# EAGLE design harp audio switch v1.0 (EAGLE 6.5.0)

## Sheet 1 of 3
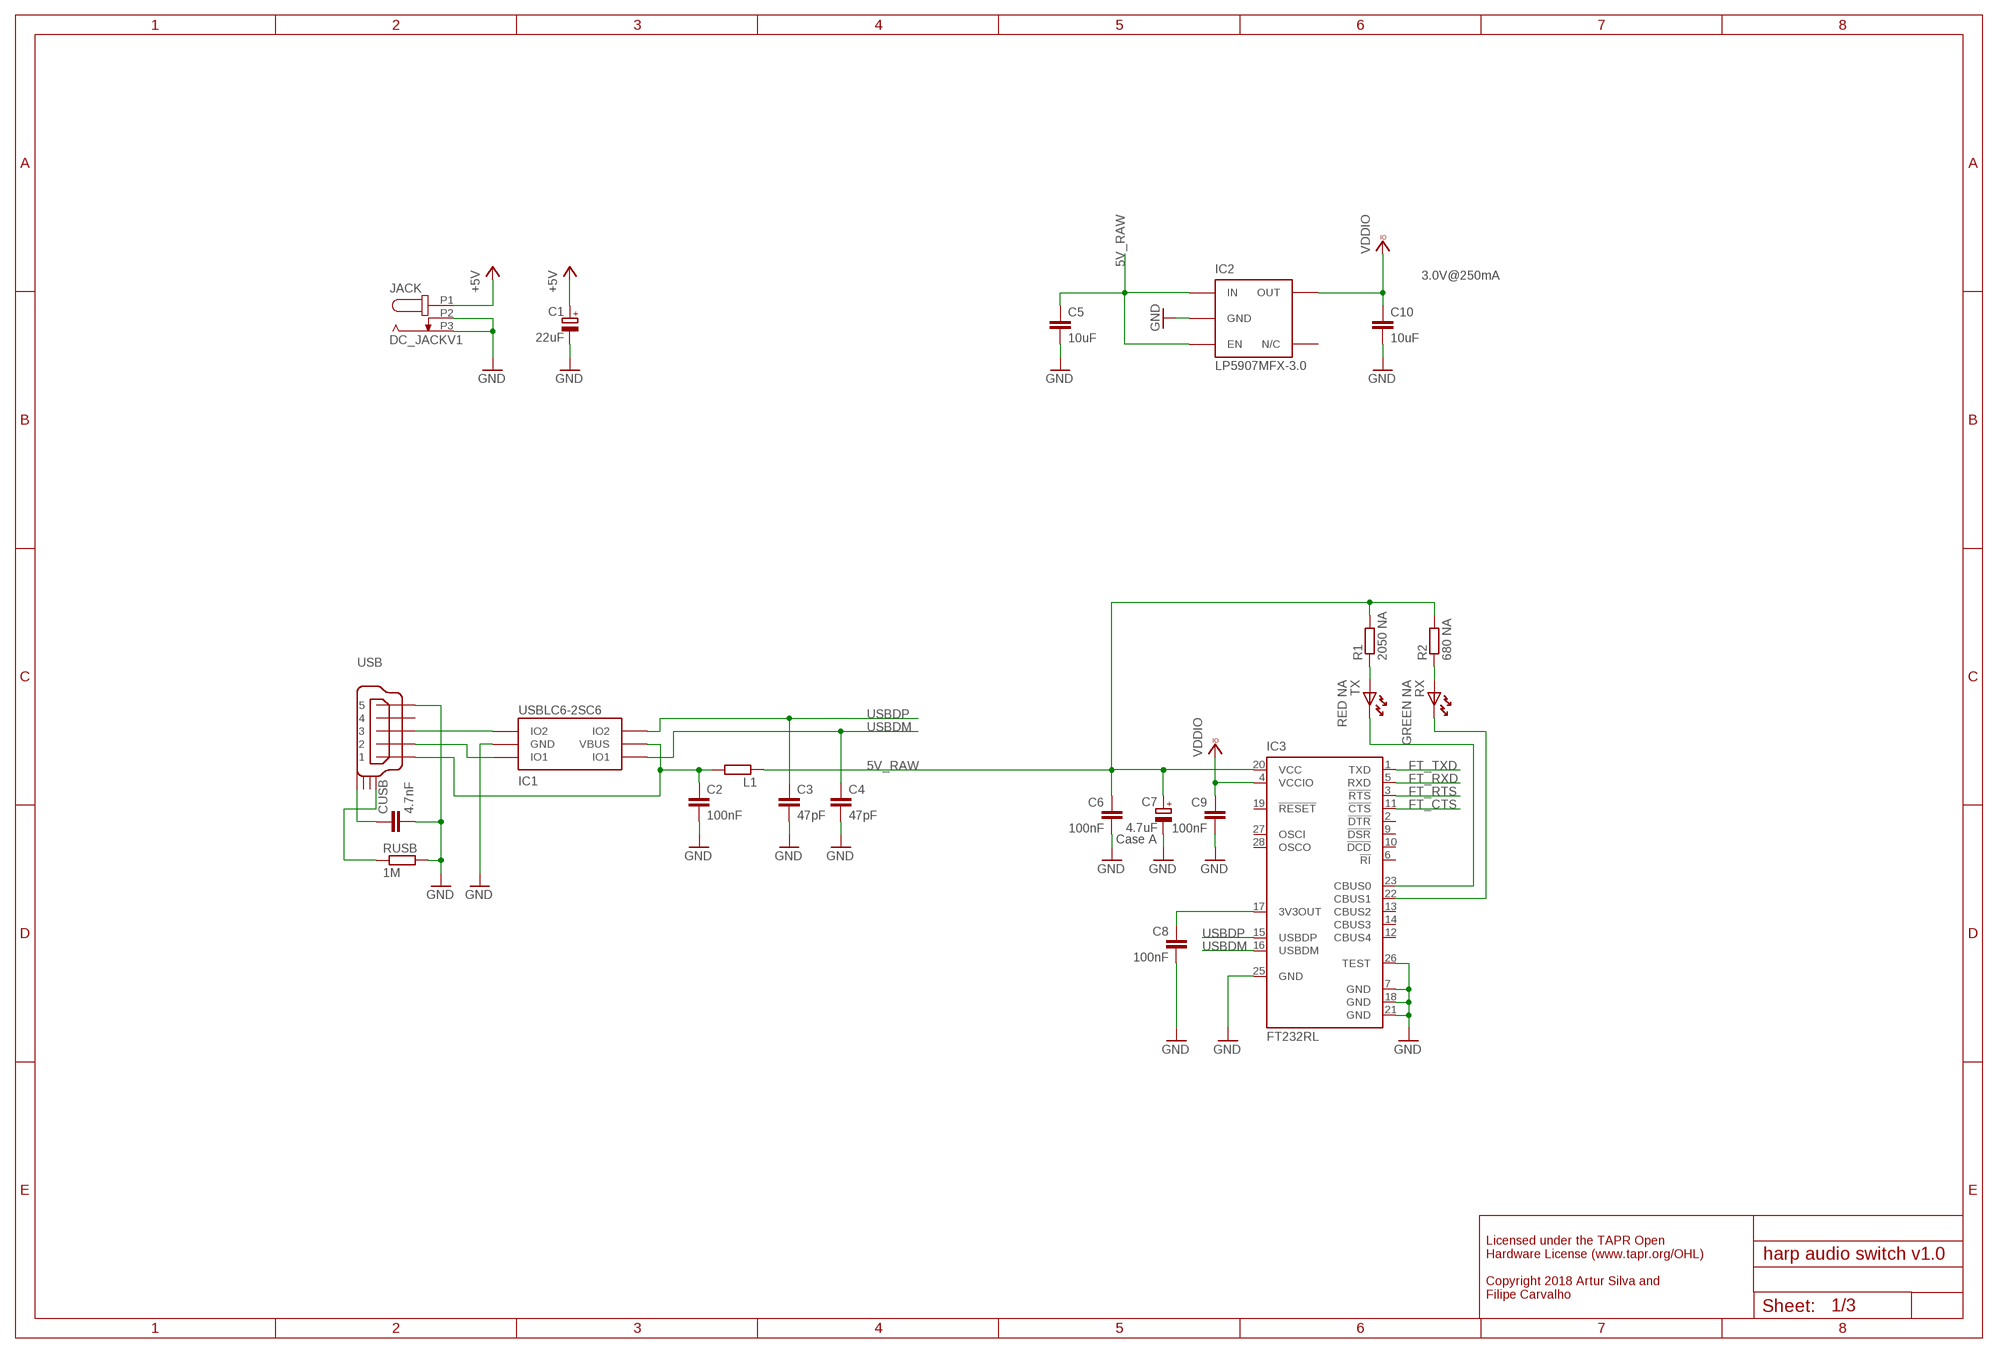
[diagram p0: schematic, sheet 1]

### Parts
C1  22uF  CAP_100UFHAND  [CAP_100UF_HAND]
C2  100nF  C-EUC0402  [C0402]
C3  47pF  C-EUC0402  [C0402]
C4  47pF  C-EUC0402  [C0402]
C5  10uF  C-EUC0603  [C0603]
C6  100nF  C-EUC0402  [C0402]
C7  4.7uF  CPOL-EUA/3216-18W  [A/3216-18W]
C8  100nF  C-EUC0402  [C0402]
C9  100nF  C-EUC0402  [C0402]
C10  10uF  C-EUC0603  [C0603]
CUSB  4.7nF  C-EUC0402  [C0402]
IC1  USBLC6-2SC6  USBLC6-2  [SOT23-6L]
IC2  LP5907MFX-3.0  TLV700XX  [TSOT23-5]
IC3  FT232RL  [SSOP28]
JACK  DC_JACKV1  [DC_POWER_INPUT]
L1  ???  R-EU_R0805  [R0805]
R1  2050 NA  R-EU_R0402  [R0402]
R2  680 NA  R-EU_R0402  [R0402]
RUSB  1M  R-EU_R0402  [R0402]
RX  GREEN NA  LEDHAND  [LED_HAND]
TX  RED NA  LEDHAND  [LED_HAND]
USB  USB_MINI_B  [240-0002-1]

### Nets
5V_RAW: C5.1 C6.1 C7.+ IC2.1(IN) IC2.3(EN) IC3.20(VCC) L1.1 R1.2 R2.2
+5V: C1.+ JACK.P1 ; also sheet 2,3
FT_CTS: IC3.11(!CTS) ; also sheet 2
FT_RTS: IC3.3(!RTS) ; also sheet 2
FT_RXD: IC3.5(RXD) ; also sheet 2
FT_TXD: IC3.1(TXD) ; also sheet 2
GND: C1.- C2.2 C3.2 C4.2 C5.2 C6.2 C7.- C8.2 C9.2 C10.2 CUSB.2 IC1.P$2(GND) IC2.2(GND) IC3.7(GND) IC3.18(GND) IC3.21(GND) IC3.25(GND) IC3.26(TEST) JACK.P2 JACK.P3 RUSB.2 USB.P$5 ; also sheet 2,3
N$38: C8.1 IC3.17(3V3OUT)
N$39: C2.1 IC1.P$5(VBUS) L1.2 USB.P$1
N$40: IC1.P$1(IO1) USB.P$2
N$47: R2.1 RX.A
N$48: IC3.23(CBUS0) TX.K
N$49: IC3.22(CBUS1) RX.K
N$50: IC1.P$3(IO2) USB.P$3
N$59: CUSB.1 USB.SHIELD_4
N$61: RUSB.1 USB.SHIELD_1
N$62: R1.1 TX.A
USBDM: C4.1 IC1.P$6(IO1) IC3.16(USBDM)
USBDP: C3.1 IC1.P$4(IO2) IC3.15(USBDP)
VCCIO: C9.1 C10.1 IC2.5(OUT) IC3.4(VCCIO) ; supply symbol labelled VDDIO ; also sheet 2,3
Unconnected: IC2.4(N/C) IC3.2(!DTR) IC3.6(!RI) IC3.9(!DSR) IC3.10(!DCD) IC3.12(CBUS4) IC3.13(CBUS2) IC3.14(CBUS3) IC3.19(!RESET) IC3.27(OSCI) IC3.28(OSCO) USB.P$4 USB.SHIELD_2 USB.SHIELD_3

### Notes on the sheet
- 3.0V@250mA
- Case A
- Licensed under the TAPR Open
  Hardware License (www.tapr.org/OHL)
  
  Copyright 2018 Artur Silva and 
  Filipe Carvalho

## Sheet 2 of 3
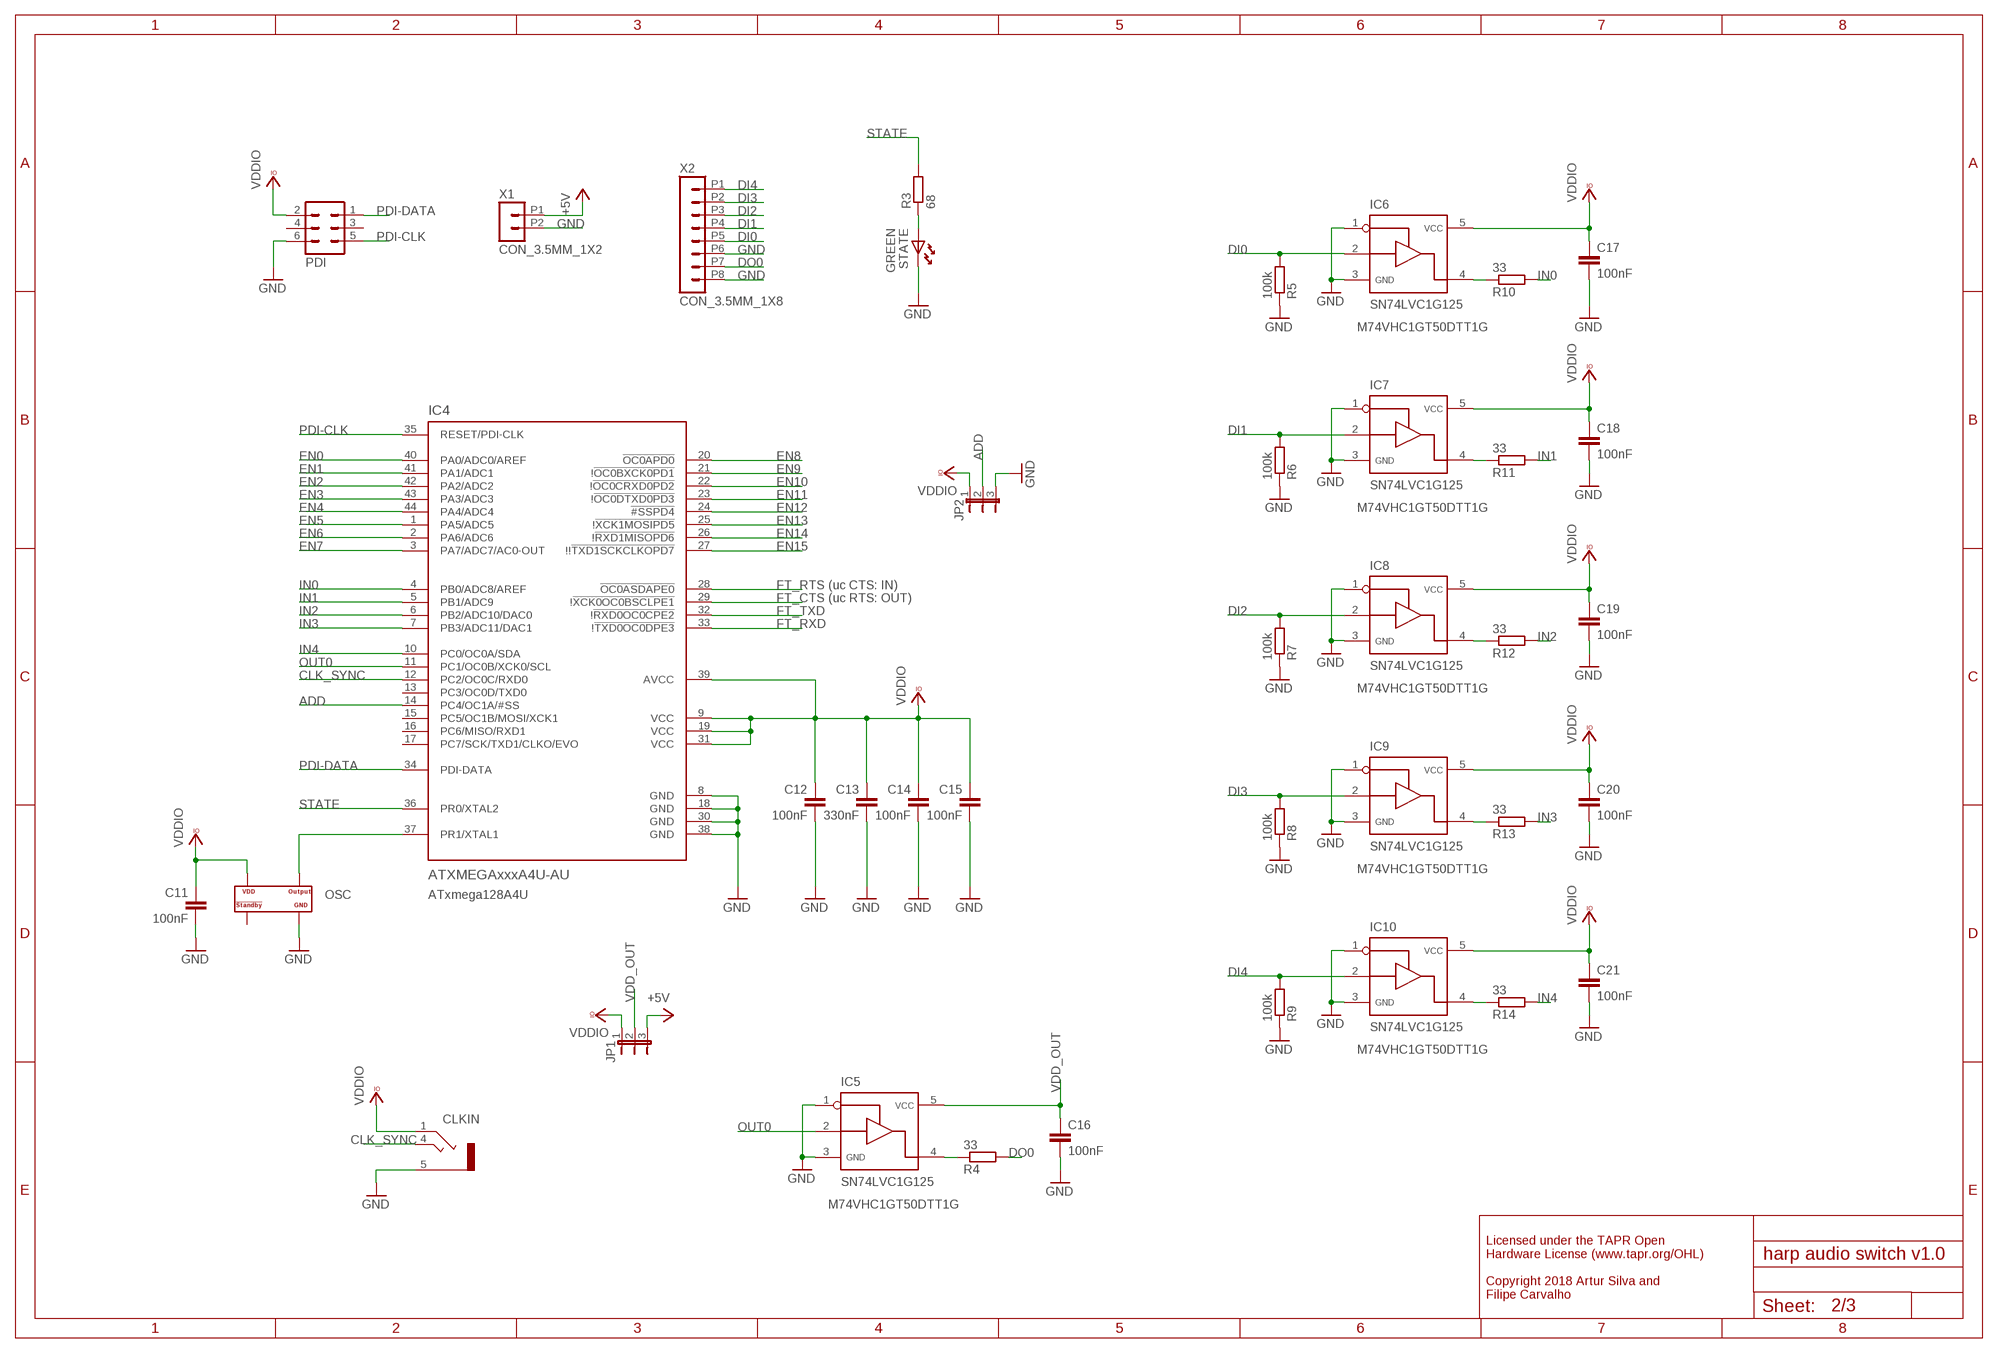
[diagram p1: schematic, sheet 2]

### Parts
C11  100nF  C-EUC0402  [C0402]
C12  100nF  C-EUC0402  [C0402]
C13  330nF  C-EUC0402  [C0402]
C14  100nF  C-EUC0402  [C0402]
C15  100nF  C-EUC0402  [C0402]
C16  100nF  C-EUC0402  [C0402]
C17  100nF  C-EUC0402  [C0402]
C18  100nF  C-EUC0402  [C0402]
C19  100nF  C-EUC0402  [C0402]
C20  100nF  C-EUC0402  [C0402]
C21  100nF  C-EUC0402  [C0402]
CLKIN  STEREO_JACK  [35RASMT2BHNTRX]
IC4  ATXMEGAxxxA4U-AU  AT-XMEGA-XXA4-AU  [QFP80P1200X1200X120-44N]
IC5  SN74LVC1G125  [SOT23-5]
IC6  SN74LVC1G125  [SOT23-5]
IC7  SN74LVC1G125  [SOT23-5]
IC8  SN74LVC1G125  [SOT23-5]
IC9  SN74LVC1G125  [SOT23-5]
IC10  SN74LVC1G125  [SOT23-5]
JP1  JP2E  [JP2]
JP2  JP2E  [JP2]
OSC  OSCILLATOR  [OSCILLATOR_3.2X2.5]
PDI  MA03-2  [MA03-2]
R3  68  R-EU_R0402  [R0402]
R4  33  R-EU_R0402  [R0402]
R5  100k  R-EU_R0402  [R0402]
R6  100k  R-EU_R0402  [R0402]
R7  100k  R-EU_R0402  [R0402]
R8  100k  R-EU_R0402  [R0402]
R9  100k  R-EU_R0402  [R0402]
R10  33  R-EU_R0402  [R0402]
R11  33  R-EU_R0402  [R0402]
R12  33  R-EU_R0402  [R0402]
R13  33  R-EU_R0402  [R0402]
R14  33  R-EU_R0402  [R0402]
STATE  GREEN  LEDHAND  [LED_HAND]
X1  CON_3.5MM_1X2  [CON_3.5MM_1X2]
X2  CON_3.5MM_1X8  [CON_3.5MM_1X8]

### Nets
+5V: JP1.3 X1.P1 ; also sheet 1,3
ADD: IC4.14(PC4/OC1A/#SS) JP2.2
CLK_SYNC: CLKIN.4 IC4.12(PC2/OC0C/RXD0)
DI0: IC6.2 R5.2 X2.P5
DI1: IC7.2 R6.2 X2.P4
DI2: IC8.2 R7.2 X2.P3
DI3: IC9.2 R8.2 X2.P2
DI4: IC10.2 R9.2 X2.P1
DO0: R4.2 X2.P7
EN0: IC4.40(PA0/ADC0/AREF) ; also sheet 3
EN1: IC4.41(PA1/ADC1) ; also sheet 3
EN2: IC4.42(PA2/ADC2) ; also sheet 3
EN3: IC4.43(PA3/ADC3) ; also sheet 3
EN4: IC4.44(PA4/ADC4) ; also sheet 3
EN5: IC4.1(PA5/ADC5) ; also sheet 3
EN6: IC4.2(PA6/ADC6) ; also sheet 3
EN7: IC4.3(PA7/ADC7/AC0-OUT) ; also sheet 3
EN8: IC4.20(!OC0APD0) ; also sheet 3
EN9: IC4.21(!!OC0BXCK0PD1) ; also sheet 3
EN10: IC4.22(!!OC0CRXD0PD2) ; also sheet 3
EN11: IC4.23(!!OC0DTXD0PD3) ; also sheet 3
EN12: IC4.24(!#SSPD4) ; also sheet 3
EN13: IC4.25(!!XCK1MOSIPD5) ; also sheet 3
EN14: IC4.26(!!RXD1MISOPD6) ; also sheet 3
EN15: IC4.27(!!!TXD1SCKCLKOPD7) ; also sheet 3
FT_CTS: IC4.29(!!XCK0OC0BSCLPE1) ; also sheet 1
FT_RTS: IC4.28(!OC0ASDAPE0) ; also sheet 1
FT_RXD: IC4.33(!!TXD0OC0DPE3) ; also sheet 1
FT_TXD: IC4.32(!!RXD0OC0CPE2) ; also sheet 1
GND: C11.2 C12.2 C13.2 C14.2 C15.2 C16.2 C17.2 C18.2 C19.2 C20.2 C21.2 CLKIN.5 IC4.8(GND) IC4.18(GND) IC4.30(GND) IC4.38(GND) IC5.1 IC5.3 IC6.1 IC6.3 IC7.1 IC7.3 IC8.1 IC8.3 IC9.1 IC9.3 IC10.1 IC10.3 JP2.3 OSC.P$2(GND) PDI.6 R5.1 R6.1 R7.1 R8.1 R9.1 STATE.K X1.P2 X2.P6 X2.P8 ; also sheet 1,3
IN0: IC4.4(PB0/ADC8/AREF) R10.2
IN1: IC4.5(PB1/ADC9) R11.2
IN2: IC4.6(PB2/ADC10/DAC0) R12.2
IN3: IC4.7(PB3/ADC11/DAC1) R13.2
IN4: IC4.10(PC0/OC0A/SDA) R14.2
N$2: IC5.4 R4.1
N$3: IC7.4 R11.1
N$4: IC6.4 R10.1
N$5: IC8.4 R12.1
N$6: IC9.4 R13.1
N$7: IC10.4 R14.1
N$23: R3.1 STATE.A
OSC2: IC4.37(PR1/XTAL1) OSC.P$3(OUTPUT)
OUT0: IC4.11(PC1/OC0B/XCK0/SCL) IC5.2
PDI-CLK: IC4.35(RESET/PDI-CLK) PDI.5
PDI-DATA: IC4.34(PDI-DATA) PDI.1
STATE: IC4.36(PR0/XTAL2) R3.2
VCCIO: C11.1 C12.1 C13.1 C14.1 C15.1 C17.1 C18.1 C19.1 C20.1 C21.1 CLKIN.1 IC4.9(VCC) IC4.19(VCC) IC4.31(VCC) IC4.39(AVCC) IC6.5 IC7.5 IC8.5 IC9.5 IC10.5 JP1.1 JP2.1 OSC.P$4(VDD) PDI.2 ; supply symbol labelled VDDIO ; also sheet 1,3
VDD_OUT: C16.1 IC5.5 JP1.2
Unconnected: IC4.13(PC3/OC0D/TXD0) IC4.15(PC5/OC1B/MOSI/XCK1) IC4.16(PC6/MISO/RXD1) IC4.17(PC7/SCK/TXD1/CLKO/EVO) OSC.P$1(STANDBY#) PDI.3 PDI.4

### Notes on the sheet
- M74VHC1GT50DTT1G
- M74VHC1GT50DTT1G
- (uc CTS: IN)
- (uc RTS: OUT)
- M74VHC1GT50DTT1G
- M74VHC1GT50DTT1G
- ATxmega128A4U
- M74VHC1GT50DTT1G
- M74VHC1GT50DTT1G
- Licensed under the TAPR Open
  Hardware License (www.tapr.org/OHL)
  
  Copyright 2018 Artur Silva and 
  Filipe Carvalho

## Sheet 3 of 3
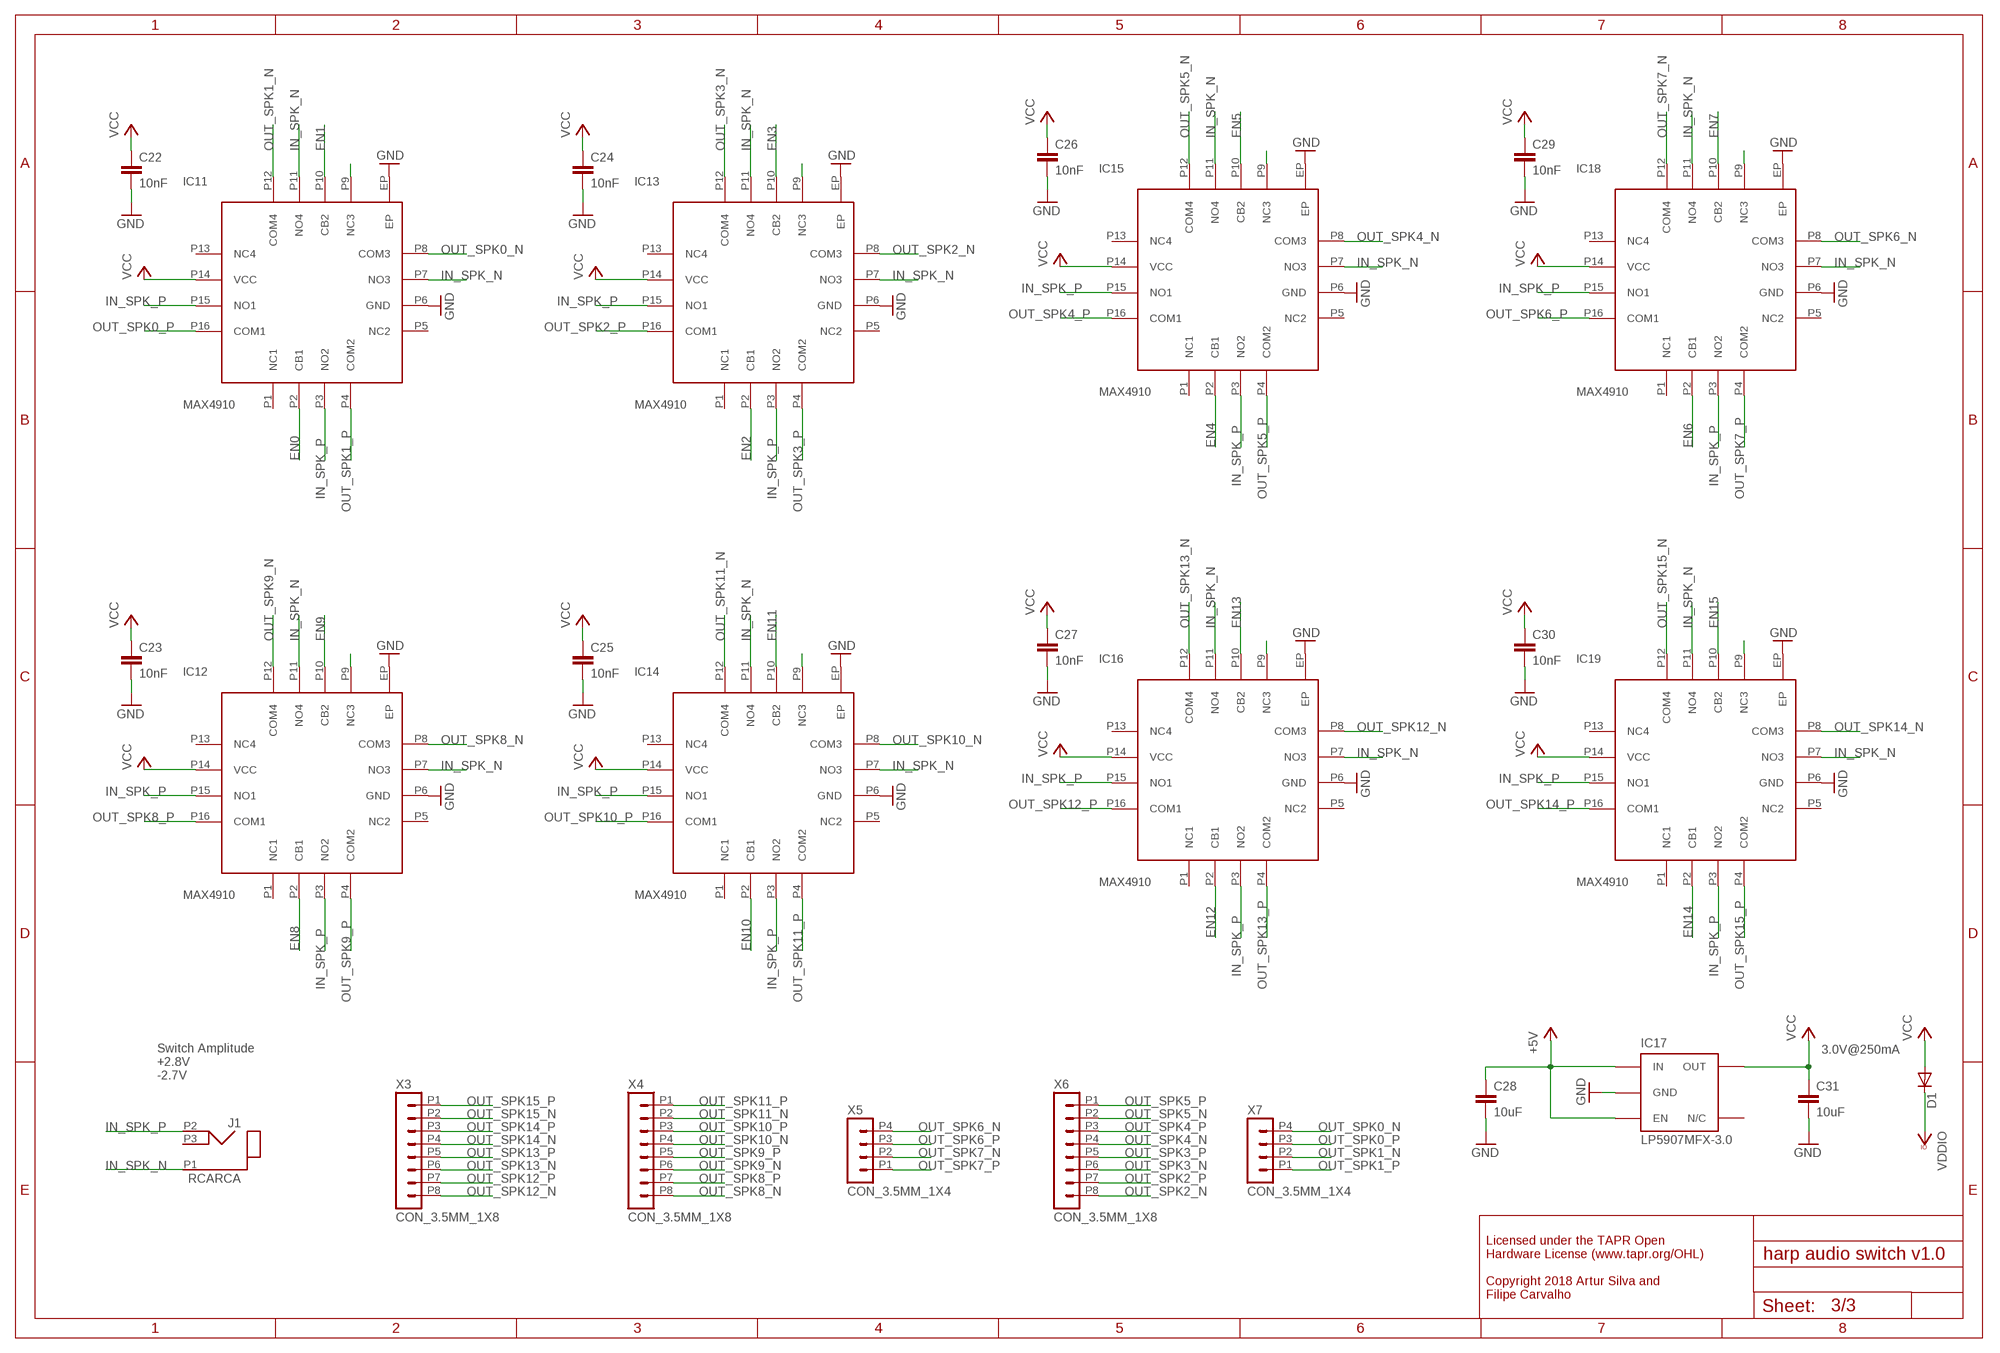
[diagram p2: schematic, sheet 3]

### Parts
C22  10nF  C-EUC0402  [C0402]
C23  10nF  C-EUC0402  [C0402]
C24  10nF  C-EUC0402  [C0402]
C25  10nF  C-EUC0402  [C0402]
C26  10nF  C-EUC0402  [C0402]
C27  10nF  C-EUC0402  [C0402]
C28  10uF  C-EUC0603  [C0603]
C29  10nF  C-EUC0402  [C0402]
C30  10nF  C-EUC0402  [C0402]
C31  10uF  C-EUC0603  [C0603]
D1  DIODE-SOD323-R  [SOD323-R]
IC11  MAX4910  [QFN16]
IC12  MAX4910  [QFN16]
IC13  MAX4910  [QFN16]
IC14  MAX4910  [QFN16]
IC15  MAX4910  [QFN16]
IC16  MAX4910  [QFN16]
IC17  LP5907MFX-3.0  TLV700XX  [TSOT23-5]
IC18  MAX4910  [QFN16]
IC19  MAX4910  [QFN16]
J1  RCARCA  [RCA]
X3  CON_3.5MM_1X8  [CON_3.5MM_1X8]
X4  CON_3.5MM_1X8  [CON_3.5MM_1X8]
X5  CON_3.5MM_1X4  [CON_3.5MM_1X4]
X6  CON_3.5MM_1X8  [CON_3.5MM_1X8]
X7  CON_3.5MM_1X4  [CON_3.5MM_1X4]

### Nets
+5V: C28.1 IC17.1(IN) IC17.3(EN) ; also sheet 1,2
EN0: IC11.P2(CB1) ; also sheet 2
EN1: IC11.P10(CB2) ; also sheet 2
EN2: IC13.P2(CB1) ; also sheet 2
EN3: IC13.P10(CB2) ; also sheet 2
EN4: IC15.P2(CB1) ; also sheet 2
EN5: IC15.P10(CB2) ; also sheet 2
EN6: IC18.P2(CB1) ; also sheet 2
EN7: IC18.P10(CB2) ; also sheet 2
EN8: IC12.P2(CB1) ; also sheet 2
EN9: IC12.P10(CB2) ; also sheet 2
EN10: IC14.P2(CB1) ; also sheet 2
EN11: IC14.P10(CB2) ; also sheet 2
EN12: IC16.P2(CB1) ; also sheet 2
EN13: IC16.P10(CB2) ; also sheet 2
EN14: IC19.P2(CB1) ; also sheet 2
EN15: IC19.P10(CB2) ; also sheet 2
GND: C22.2 C23.2 C24.2 C25.2 C26.2 C27.2 C28.2 C29.2 C30.2 C31.2 IC11.EP IC11.P6(GND) IC12.EP IC12.P6(GND) IC13.EP IC13.P6(GND) IC14.EP IC14.P6(GND) IC15.EP IC15.P6(GND) IC16.EP IC16.P6(GND) IC17.2(GND) IC18.EP IC18.P6(GND) IC19.EP IC19.P6(GND) ; also sheet 1,2
IN_SPK_N: IC11.P7(NO3) IC11.P11(NO4) IC12.P7(NO3) IC12.P11(NO4) IC13.P7(NO3) IC13.P11(NO4) IC14.P7(NO3) IC14.P11(NO4) IC15.P7(NO3) IC15.P11(NO4) IC16.P7(NO3) IC16.P11(NO4) IC18.P7(NO3) IC18.P11(NO4) IC19.P7(NO3) IC19.P11(NO4) J1.P1
IN_SPK_P: IC11.P3(NO2) IC11.P15(NO1) IC12.P3(NO2) IC12.P15(NO1) IC13.P3(NO2) IC13.P15(NO1) IC14.P3(NO2) IC14.P15(NO1) IC15.P3(NO2) IC15.P15(NO1) IC16.P3(NO2) IC16.P15(NO1) IC18.P3(NO2) IC18.P15(NO1) IC19.P3(NO2) IC19.P15(NO1) J1.P2
N$11: IC19.P9(NC3)
N$12: IC13.P9(NC3)
N$13: IC16.P9(NC3)
N$14: IC12.P9(NC3)
N$15: IC14.P9(NC3)
N$16: IC11.P9(NC3)
N$18: IC15.P9(NC3)
N$19: IC18.P9(NC3)
OUT_SPK0_N: IC11.P8(COM3) X7.P4
OUT_SPK0_P: IC11.P16(COM1) X7.P3
OUT_SPK1_N: IC11.P12(COM4) X7.P2
OUT_SPK1_P: IC11.P4(COM2) X7.P1
OUT_SPK2_N: IC13.P8(COM3) X6.P8
OUT_SPK2_P: IC13.P16(COM1) X6.P7
OUT_SPK3_N: IC13.P12(COM4) X6.P6
OUT_SPK3_P: IC13.P4(COM2) X6.P5
OUT_SPK4_N: IC15.P8(COM3) X6.P4
OUT_SPK4_P: IC15.P16(COM1) X6.P3
OUT_SPK5_N: IC15.P12(COM4) X6.P2
OUT_SPK5_P: IC15.P4(COM2) X6.P1
OUT_SPK6_N: IC18.P8(COM3) X5.P4
OUT_SPK6_P: IC18.P16(COM1) X5.P3
OUT_SPK7_N: IC18.P12(COM4) X5.P2
OUT_SPK7_P: IC18.P4(COM2) X5.P1
OUT_SPK8_N: IC12.P8(COM3) X4.P8
OUT_SPK8_P: IC12.P16(COM1) X4.P7
OUT_SPK9_N: IC12.P12(COM4) X4.P6
OUT_SPK9_P: IC12.P4(COM2) X4.P5
OUT_SPK10_N: IC14.P8(COM3) X4.P4
OUT_SPK10_P: IC14.P16(COM1) X4.P3
OUT_SPK11_N: IC14.P12(COM4) X4.P2
OUT_SPK11_P: IC14.P4(COM2) X4.P1
OUT_SPK12_N: IC16.P8(COM3) X3.P8
OUT_SPK12_P: IC16.P16(COM1) X3.P7
OUT_SPK13_N: IC16.P12(COM4) X3.P6
OUT_SPK13_P: IC16.P4(COM2) X3.P5
OUT_SPK14_N: IC19.P8(COM3) X3.P4
OUT_SPK14_P: IC19.P16(COM1) X3.P3
OUT_SPK15_N: IC19.P12(COM4) X3.P2
OUT_SPK15_P: IC19.P4(COM2) X3.P1
VCC: C22.1 C23.1 C24.1 C25.1 C26.1 C27.1 C29.1 C30.1 C31.1 D1.A IC11.P14(VCC) IC12.P14(VCC) IC13.P14(VCC) IC14.P14(VCC) IC15.P14(VCC) IC16.P14(VCC) IC17.5(OUT) IC18.P14(VCC) IC19.P14(VCC)
VCCIO: D1.C ; supply symbol labelled VDDIO ; also sheet 1,2
Unconnected: IC11.P1(NC1) IC11.P5(NC2) IC11.P13(NC4) IC12.P1(NC1) IC12.P5(NC2) IC12.P13(NC4) IC13.P1(NC1) IC13.P5(NC2) IC13.P13(NC4) IC14.P1(NC1) IC14.P5(NC2) IC14.P13(NC4) IC15.P1(NC1) IC15.P5(NC2) IC15.P13(NC4) IC16.P1(NC1) IC16.P5(NC2) IC16.P13(NC4) IC17.4(N/C) IC18.P1(NC1) IC18.P5(NC2) IC18.P13(NC4) IC19.P1(NC1) IC19.P5(NC2) IC19.P13(NC4) J1.P3

### Notes on the sheet
- 3.0V@250mA
- Switch Amplitude
  +2.8V
  -2.7V
- Licensed under the TAPR Open
  Hardware License (www.tapr.org/OHL)
  
  Copyright 2018 Artur Silva and 
  Filipe Carvalho

## Library data of the parts
C1 = CNP-miscellaneous:CAP_100UF
C2-C6 C8-C31 CUSB = rcl:C-EU: CAPACITOR, European symbol
C7 = rcl:CPOL-EU: POLARIZED CAPACITOR, European symbol
CLKIN = CNP-connectors:STEREO_JACK
D1 = diode:DIODE-: DIODE
IC1 = CNP 2:USBLC6-2
IC2 IC17 = CNP:TLV700XX
IC3 = ftdichip:FT232R: Source: http://www.ftdichip.com/Documents/DataSheets/DS_FT232R_v104.pdf; MPN: FT232RL; OC_FARNELL: 1146032; OC_NEWARK: 91K9918
IC4 = xmega-a4:AT-XMEGA-XXA4-AU: ATxMega a4 Serie
IC5-IC10 = My_library 0v2:SN74LVC1G125
IC11-IC16 IC18 IC19 = CNP-ics 1:MAX4910
J1 = CNP-connectors:RCA
JACK = CNP-miscellaneous:DC_JACK
JP1 JP2 = jumper:JP2E: JUMPER
L1 R1-R14 RUSB = rcl:R-EU_: RESISTOR, European symbol
OSC = CNP-miscellaneous:OSCILLATOR
PDI = con-lstb:MA03-2: PIN HEADER; OC_FARNELL: unknown; OC_NEWARK: unknown
RX STATE TX = CNP-miscellaneous:LED
USB = CNP-connectors:USB_MINI_B
X1 = CNP-connectors:CON_3.5MM_1X2
X2-X4 X6 = CNP-connectors:CON_3.5MM_1X8
X5 X7 = CNP-connectors:CON_3.5MM_1X4

## Board
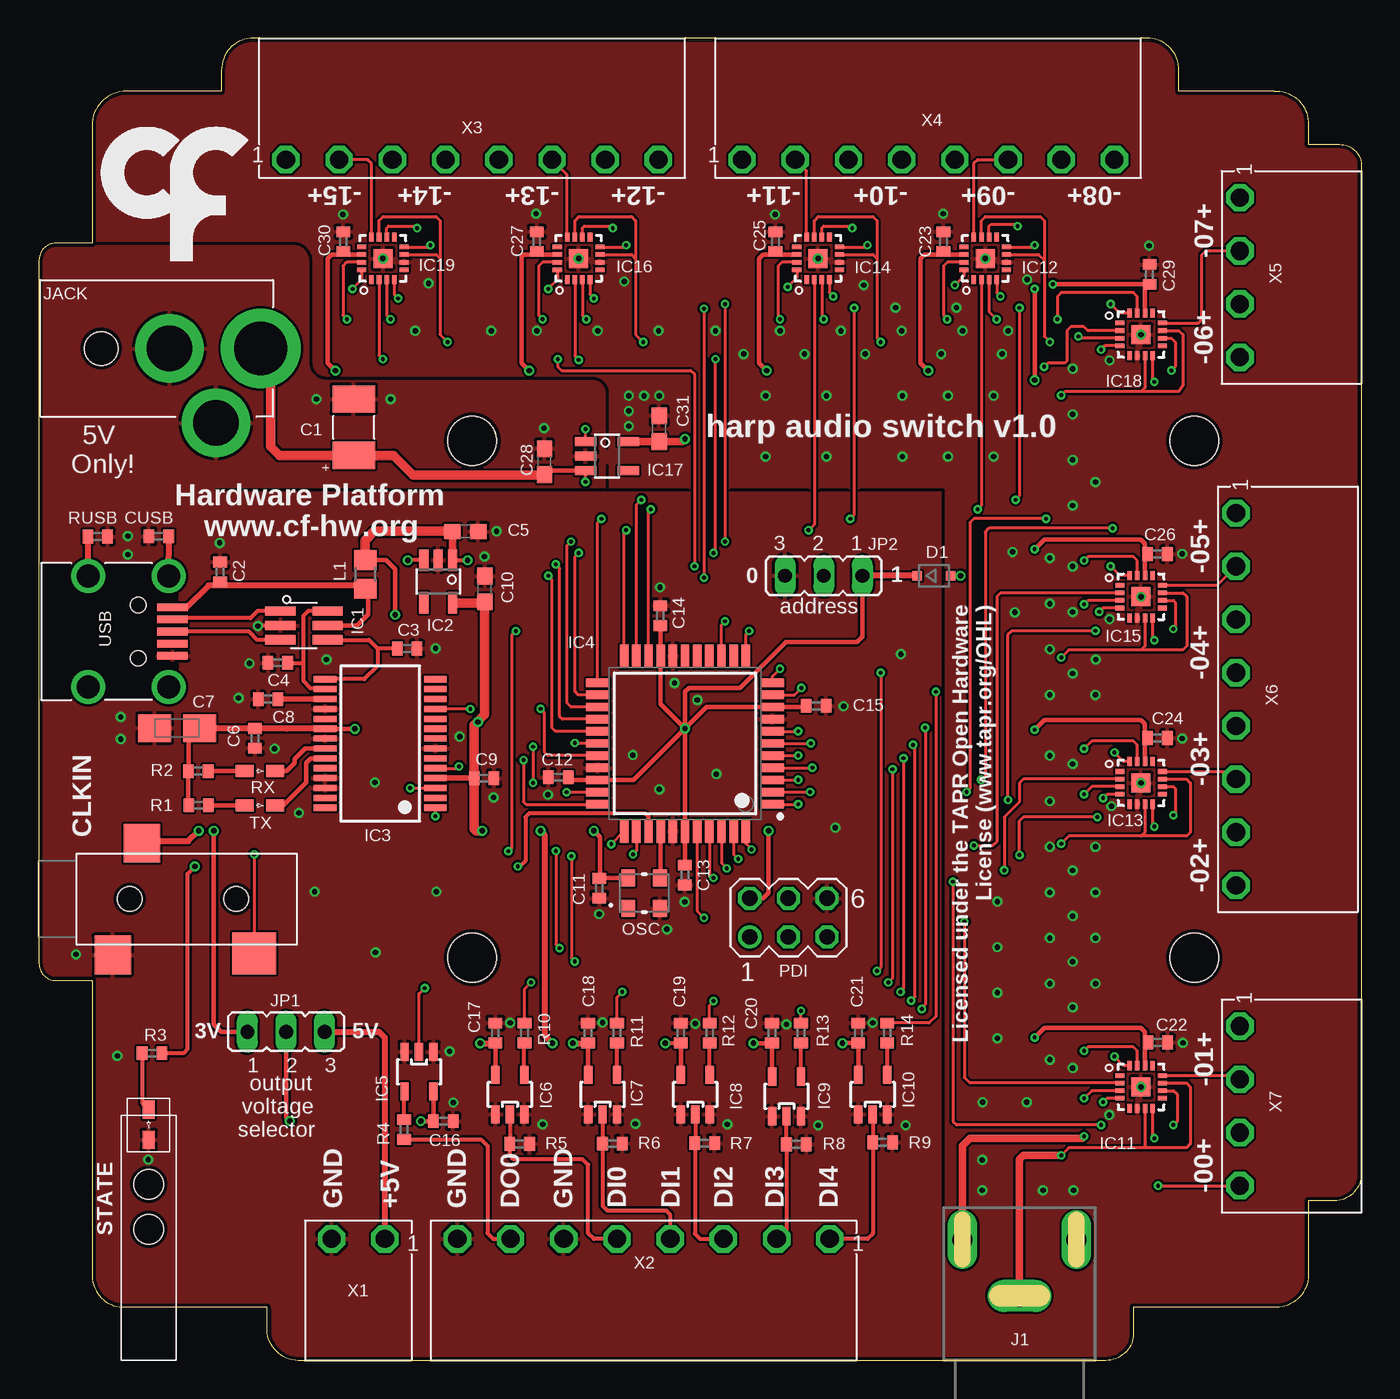
[diagram p3: board, top side]
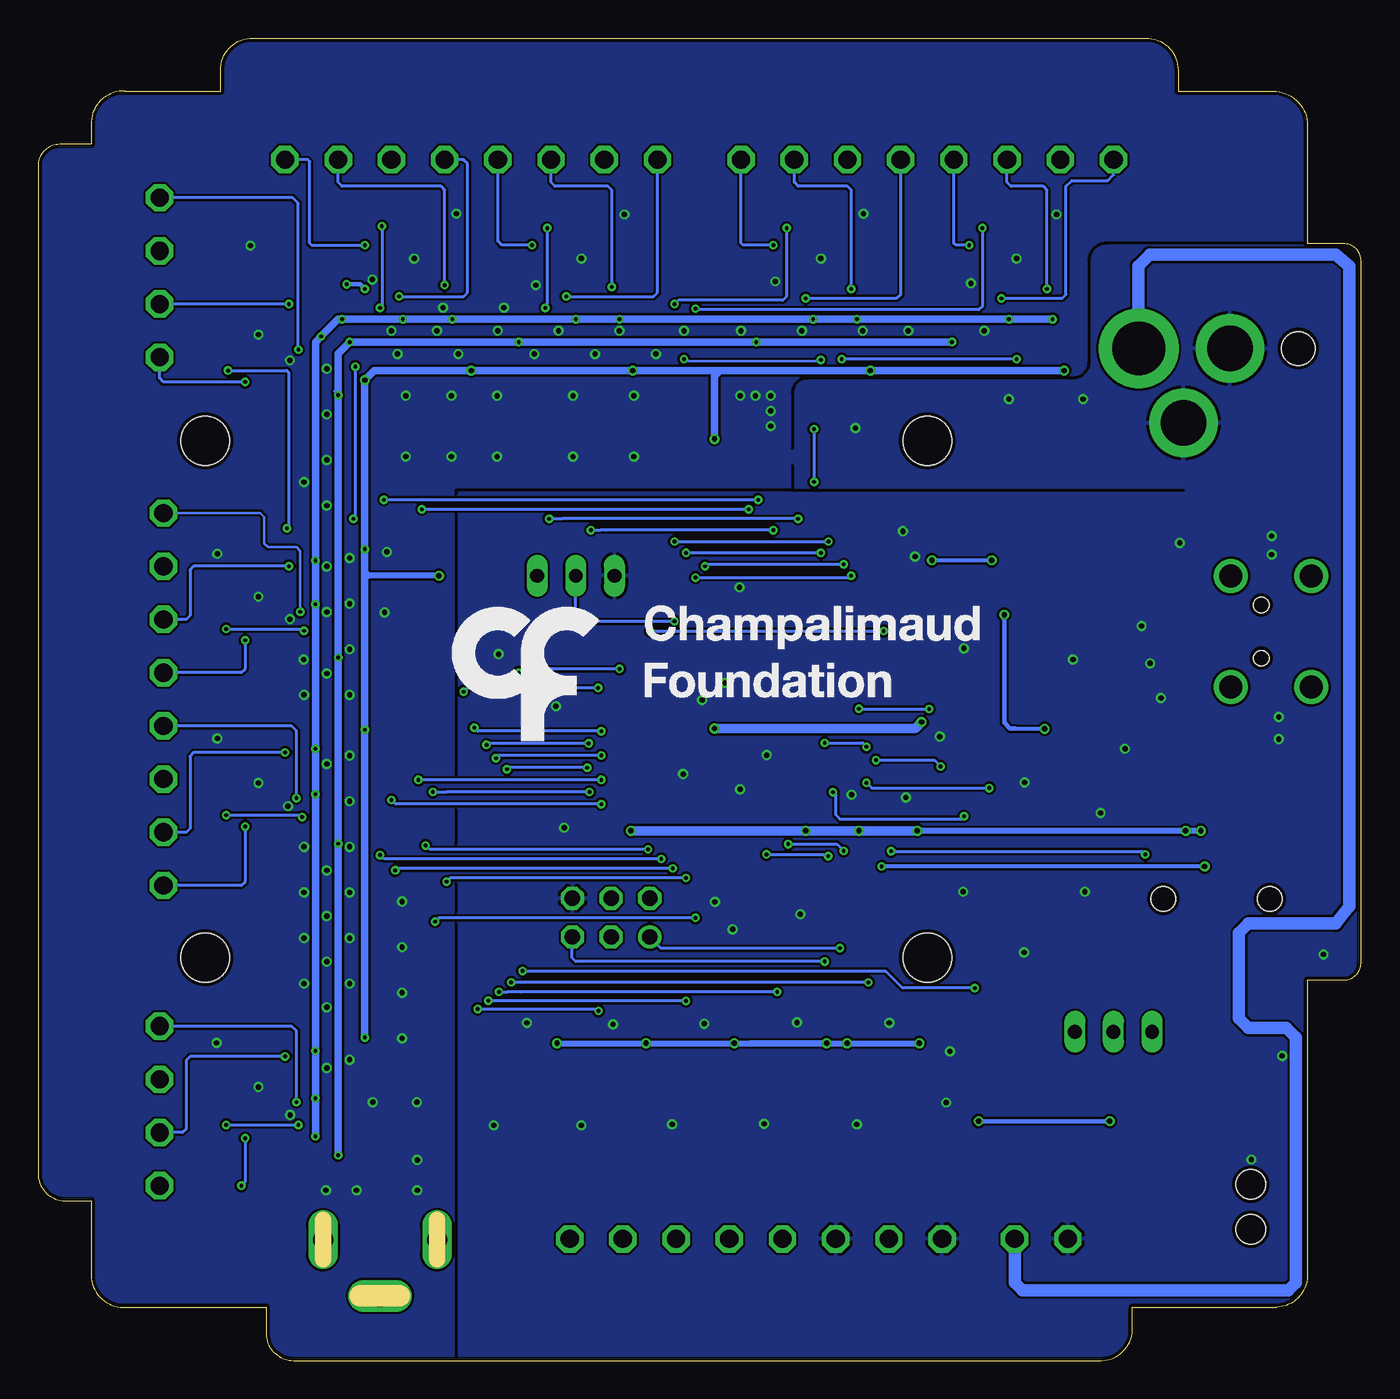
[diagram p4: board, bottom side, seen from below]

Size 87 x 87 mm. Coordinates in mm from the lower left corner, seen from the top.
Outline: 3.5,81.27 3.5,73.5 1.12,73.5 arc90 0,72.38 0,26.12 arc90 1.12,25 3.5,25 3.5,5.74 arc90 5.5,3.5 15,3.5 15,1.99 arc90 17.24,0 70.2,0 arc90 72,1.81 72,3.5 81.39,3.5 arc90 83.5,5.62 83.5,10.5 85.2,10.5 arc90 87,12.31 87,78.59 arc90 85.59,80 83.5,80 83.5,81.5 arc90 81.26,83.5 75,83.5 75,84.88 arc90 72.88,87 14.12,87 arc90 12,84.88 12,83.5 5.74,83.5 arc90 3.5,81.27
Copper layers (1*16): Top 0.018mm / dielectric 1.55mm / Bottom 0.018mm
Design rules "eC_2Layer_PClass6_BaseCopperO18_eCDefault *": minimum track width 0.15mm, minimum drill 0.25mm, track to track 0.15mm, track to pad 0.15mm, pad to pad 0.15mm, via to via 0.15mm, smd to smd 0mil, copper to edge 0.25mm, drill to drill 0.35mm, minimum pad ring 0.125mm, minimum via ring 0.125mm, stop-mask expansion 0mil, vias tented up to drill 0.45mm, thermal gap 0.2mm
Holes 3.2 mm at 28.5,60.5 28.5,26.5 76,60.5 76,26.5
tRestrict: 14 lines
bRestrict: 15 lines

### Footprints (pad centres in the part's own frame; a part is rotated, then mirrored left to right if it is on the bottom)
CAP_100UF_HAND = smd 1.8 x 2.8: + -1.85,0; - 1.85,0
C0402 = smd 0.7 x 0.9: 1 -0.65,0; 2 0.65,0
C0603 = smd 1.1 x 1: 1 -0.85,0; 2 0.85,0
A/3216-18W = smd 2.15 x 1.8: + 1.475,0; - -1.475,0
35RASMT2BHNTRX = smd 2.4 x 2.55: 1 0.8,3.675; 5 -1.1,-3.675 | smd 2.9 x 2.75: 4 8.2,-3.575 | hole 1.6: 0,0; 7,0
SOD323-R = smd 0.6 x 0.6: A 1.1,0; C -1.1,0
SOT23-6L = smd 0.6 x 2: P$1 -0.95,-1.55; P$2 0,-1.55; P$3 0.95,-1.55; P$4 0.95,1.55; P$5 0,1.55; P$6 -0.95,1.55
TSOT23-5 = smd 0.6 x 1.408: 1 -0.95,-1.404; 2 0,-1.404; 3 0.95,-1.404; 4 0.95,1.404; 5 -0.95,1.404
SSOP28 = smd 0.4 x 1.5: 1 -4.225,-3.625; 2 -3.575,-3.625; 3 -2.925,-3.625; 4 -2.275,-3.625; 5 -1.625,-3.625; 6 -0.975,-3.625; 7 -0.325,-3.625; 8 0.325,-3.625; 9 0.975,-3.625; 10 1.625,-3.625; 11 2.275,-3.625; 12 2.925,-3.625; 13 3.575,-3.625; 14 4.225,-3.625; 15 4.225,3.625; 16 3.575,3.625; 17 2.925,3.625; 18 2.275,3.625; 19 1.625,3.625; 20 0.975,3.625; 21 0.325,3.625; 22 -0.325,3.625; 23 -0.975,3.625; 24 -1.625,3.625; 25 -2.275,3.625; 26 -2.925,3.625; 27 -3.575,3.625; 28 -4.225,3.625
QFP80P1200X1200X120-44N = smd 1.55 x 0.55: 1 -5.75,4; 2 -5.75,3.2; 3 -5.75,2.4; 4 -5.75,1.6; 5 -5.75,0.8; 6 -5.75,0; 7 -5.75,-0.8; 8 -5.75,-1.6; 9 -5.75,-2.4; 10 -5.75,-3.2; 11 -5.75,-4; 23 5.75,-4; 24 5.75,-3.2; 25 5.75,-2.4; 26 5.75,-1.6; 27 5.75,-0.8; 28 5.75,0; 29 5.75,0.8; 30 5.75,1.6; 31 5.75,2.4; 32 5.75,3.2; 33 5.75,4 | smd 0.55 x 1.55: 12 -4,-5.75; 13 -3.2,-5.75; 14 -2.4,-5.75; 15 -1.6,-5.75; 16 -0.8,-5.75; 17 0,-5.75; 18 0.8,-5.75; 19 1.6,-5.75; 20 2.4,-5.75; 21 3.2,-5.75; 22 4,-5.75; 34 4,5.75; 35 3.2,5.75; 36 2.4,5.75; 37 1.6,5.75; 38 0.8,5.75; 39 0,5.75; 40 -0.8,5.75; 41 -1.6,5.75; 42 -2.4,5.75; 43 -3.2,5.75; 44 -4,5.75
SOT23-5 = smd 0.55 x 1.2: 1 -0.95,-1.3; 2 0,-1.3; 3 0.95,-1.3; 4 0.95,1.3; 5 -0.95,1.3
QFN16 = smd 1.25 x 1.25: EP 0,0 | smd 0.3 x 0.6: P1 -0.75,-1.4; P2 -0.25,-1.4; P3 0.25,-1.4; P4 0.75,-1.4; P9 0.75,1.4; P10 0.25,1.4; P11 -0.25,1.4; P12 -0.75,1.4 | smd 0.6 x 0.3: P5 1.4,-0.75; P6 1.4,-0.25; P7 1.4,0.25; P8 1.4,0.75; P13 -1.4,0.75; P14 -1.4,0.25; P15 -1.4,-0.25; P16 -1.4,-0.75
RCA = drill 1.4 long: P1 0,0 | drill 1.3 long: P2 3.7,3.75; P3 3.7,-3.75
DC_POWER_INPUT = drill 3.5: P1 8.5,0 | drill 3: P2 2.5,0; P3 5.55,-4.9 | hole 2.2: -2,0
JP2 = drill 0.914 long: 1 -2.54,0; 2 0,0; 3 2.54,0
R0805 = smd 1.3 x 1.5: 1 -0.95,0; 2 0.95,0
OSCILLATOR_3.2X2.5 = smd 0.9 x 1.1: P$1 -1.05,-1; P$2 1.05,-1; P$3 1.05,1; P$4 -1.05,1
MA03-2 = drill 1.016: 1 -2.54,-1.27 | drill 1.016 octagon: 2 -2.54,1.27; 3 0,-1.27; 4 0,1.27; 5 2.54,-1.27; 6 2.54,1.27
R0402 = smd 0.7 x 0.9: 1 -0.65,0; 2 0.65,0
LED_HAND = smd 1.2 x 0.8: A -1,0; K 1,0
LED_PIPE_7513D2-L = hole 1.93: -1.486,0; 1.486,0
240-0002-1 = smd 0.5 x 2: P$1 -1.6,8.65; P$2 -0.8,8.65; P$3 0,8.65; P$4 0.8,8.65; P$5 1.6,8.65 | drill 1.5: SHIELD_1 -3.65,3.1; SHIELD_2 3.65,3.1; SHIELD_3 3.65,8.4; SHIELD_4 -3.65,8.4 | hole 1: -1.75,6.4; 1.75,6.4
CON_3.5MM_1X2 = drill 1.2 octagon: P1 -1.75,0; P2 1.75,0
CON_3.5MM_1X8 = drill 1.2 octagon: P1 -12.25,0; P2 -8.75,0; P3 -5.25,0; P4 -1.75,0; P5 1.75,0; P6 5.25,0; P7 8.75,0; P8 12.25,0
CON_3.5MM_1X4 = drill 1.2 octagon: P1 -5.25,0; P2 -1.75,0; P3 1.75,0; P4 5.25,0

### Placement (x,y rotation side)
C1  20.7,61.4 90 top
C2  11.92,51.88 90 top
C3  24.22,46.84 0 top
C4  15.71,45.9 180 top
C5  28.05,54.54 0 top
C6  14.21,40.93 270 top
C7  9.09,41.61 0 top
C8  15.08,43.51 180 top
C9  29.28,38.31 0 top
C10  29.33,50.76 90 top
C11  36.86,31.07 270 top
C12  34.16,38.37 180 top
C13  42.49,31.94 270 top
C14  40.88,49 90 top
C15  51.13,43.07 0 top
C16  26.6,15.75 0 top
C17  30.02,21.55 90 top
C18  36.12,21.55 90 top
C19  42.23,21.55 90 top
C20  48.23,21.55 90 top
C21  53.9,21.55 90 top
C22  73.6,20.93 0 top
C23  59.5,73.6 90 top
C24  73.58,40.95 0 top
C25  48.45,73.6 90 top
C26  73.58,53.05 0 top
C27  32.75,73.6 90 top
C28  33.25,59.13 90 top
C29  73.05,71.45 90 top
C30  20.02,73.6 90 top
C31  40.8,61.3 90 top
CLKIN  5.96,30.36 0 top
CUSB  7.88,54.22 180 top
D1  58.88,51.63 0 top
IC1  17.44,48.36 270 top
IC2  26.27,51.25 180 top
IC3  22.45,40.59 90 top
IC4  42.5,40.59 180 top
IC5  25,19 180 top
IC6  30.98,17.5 0 top
IC7  37.08,17.5 0 top
IC8  43.17,17.5 0 top
IC9  49.17,17.38 0 top
IC10  54.85,17.5 0 top
IC11  72.5,18 270 top
IC12  62.25,72.5 0 top
IC13  72.5,38 270 top
IC14  51.25,72.5 0 top
IC15  72.5,50.25 270 top
IC16  35.5,72.5 0 top
IC17  37.38,59.5 270 top
IC18  72.5,67.5 270 top
IC19  22.62,72.5 0 top
J1  64.5,4.25 90 top
JACK  6.09,66.58 0 top
JP1  16.25,21.63 0 top
JP2  51.62,51.63 180 top
L1  21.48,51.72 270 top
OSC  39.81,30.75 0 top
PDI  49.3,29.14 0 top
R1  10.5,36.53 180 top
R2  10.48,38.78 180 top
R3  7.44,20.22 0 top
R4  24.02,15.2 270 top
R5  31.62,14.25 180 top
R6  37.73,14.28 180 top
R7  43.8,14.3 180 top
R8  49.83,14.23 180 top
R9  55.5,14.35 180 top
R10  31.95,21.55 90 top
R11  38.02,21.55 90 top
R12  44.12,21.55 90 top
R13  50.12,21.55 90 top
R14  55.8,21.55 90 top
RUSB  3.87,54.21 0 top
RX  14.53,38.78 0 top
STATE  7.21,15.52 270 top
TX  14.53,36.53 0 top
U$1  [LED_PIPE_7513D2-L]  7.21,10.11 90 top
U$3  [LOGO_5]  56.68,46.47 0 bottom
U$9  [LOGO_6]  7.25,78.08 0 top
USB  0.13,47.96 270 top
X1  21,8 180 top
X2  39.77,8 180 top
X3  28.5,79 0 top
X4  58.5,79 0 top
X5  79,71.25 270 top
X6  78.75,43.5 270 top
X7  79,16.75 270 top

### Tracks (layer width: path | path; a pad name or v marks a point on that pad's centre or on a via)
5V_RAW  (via drill 0.35 pad 0.65)
  Top 0.254: IC2.3 v24.27,52.65 v24.26,52.64 | v28.2,52.64 27.22,52.64 IC2.1
  Top 0.305: 16.31,41.57 C6.1 | v20.78,41.56 IC3.20 | R1.2 9.83,36.55 R2.2 9.84,38.79 9.84,41.46 9.7,41.6 10.56,41.6 C7.+ | v23.43,49.06 23.43,52.07 22.85,52.65 21.49,52.65 L1.1 | IC2.1
  Top 0.406: IC3.20 16.31,41.57 10.61,41.57 C7.+ | L1.1 21.54,52.73
  Top 0.508: IC2.1 C5.1 | 27.16,54.5 C5.1 | 27.25,54.59 C5.1
  Top 0.61: C5.1 22.05,54.55 21.45,53.95 21.45,52.7 L1.1
  Bottom 0.254: v24.26,52.64 v28.2,52.64
  Bottom 0.305: v23.43,49.06 23.43,41.96 23.06,41.57 22.7,41.57 v20.78,41.56
+5V  (via drill 0.25 pad 0.55)
  Top 0.203: IC17.1 35.97,61.38 v35.95,61.28 | v35.95,57.8 35.95,58.53 IC17.3
  Top 0.305: IC17.3 33.52,58.55 C28.1
  Top 0.406: JP1.3 22.38,21.63 22.75,21.25 X1.P1
  Top 0.61: C28.1 33.23,58.25 24.62,58.25 23.33,59.55 C1.+ 15.83,59.55 15.25,60.13 15.25,65.93 JACK.P1
  Bottom 0.203: v35.95,61.28 v35.95,57.8
  Bottom 0.813: JACK.P1 14.62,66.62 14.62,72 13.88,72.75 1.62,72.75 0.75,72 0.75,29.88 1.62,28.75 7.38,28.75 8,28.13 8,22.5 7.38,21.88 4.88,21.88 4.25,21.25 4.25,5.13 4.75,4.63 22.25,4.63 22.75,5.13 X1.P1
ADD  (via drill 0.25 pad 0.55)
  Top 0.203: IC4.14 44.9,48.4 v45.12,48.63
  Bottom 0.203: v45.12,48.63 51.5,48.63 51.62,48.75 JP2.2
CLK_SYNC  (via drill 0.25 pad 0.55)
  Top 0.203: v14.16,33.29 CLKIN.4 | v30.88,33.5 31.12,33.75 31.12,47.75 v31.36,47.99 | IC4.12 46.5,47.78 v46.72,47.99
  Top 0.254: CLKIN.4 | v30.88,33.5 30.75,33.5
  Bottom 0.203: v30.88,33.5 14.38,33.5 v14.16,33.29 | v46.72,47.99 31.99,47.99 v31.36,47.99
DI0
  Top 0.254: IC6.2 R5.2 30.98,13.48 31.2,13.25 35.75,13.25 36.12,12.88 36.12,8.38 36.5,8 X2.P5
DI1
  Top 0.254: IC7.2 R6.2 37.08,10.18 37.38,9.88 41.25,9.88 41.5,9.63 41.5,8.03 X2.P4
DI2
  Top 0.254: IC8.2 43.17,14.33 R7.2 43.15,8.35 43.5,8 X2.P3
DI3
  Top 0.254: IC9.2 R8.2 49.17,8.65 X2.P2
DI4
  Top 0.254: IC10.2 R9.2 54.85,8.35 54.5,8 X2.P1
DO0
  Top 0.254: R4.2 29.07,14.55 29.5,14.13 29.5,8.38 29.88,8 X2.P7
EN0  (via drill 0.25 pad 0.55)
  Top 0.203: IC4.40 43.3,29.58 v43.75,29.13 | v60.88,28.88 60.88,18.63 61.25,18.25 IC11.P2
  Bottom 0.203: v43.75,29.13 60.62,29.13 v60.88,28.88
EN1  (via drill 0.25 pad 0.55)
  Top 0.203: IC11.P10 74.62,17.75 74.88,17.5 74.88,15.75 v74.62,15.5 | IC4.41 44.1,32.03 v44.38,31.75 | v60.12,31.5 60.12,15.75 60.38,15.5 v69.88,15.5
  Bottom 0.203: v74.62,15.5 v69.88,15.5 | v44.38,31.75 59.88,31.75 v60.12,31.5
EN2  (via drill 0.25 pad 0.55)
  Top 0.203: IC13.P2 64.75,38.25 64.5,38 64.5,36.75 63.5,35.75 v63.5,32.25 | IC4.42 44.9,32.73 v45.25,32.38
  Bottom 0.203: v45.25,32.38 63.25,32.38 v63.5,32.25
EN3  (via drill 0.25 pad 0.55)
  Top 0.203: IC13.P10 74.62,37.75 74.75,37.63 74.75,36 v74.62,35.88 | v69.62,35.75 64.75,35.75 64.5,35.5 v64.5,33.25 | IC4.43 45.7,33.3 v46,33
  Bottom 0.203: v74.62,35.88 69.75,35.88 v69.62,35.75 | v46,33 64.25,33 v64.5,33.25
EN4  (via drill 0.25 pad 0.55)
  Top 0.203: IC15.P2 63.25,50.5 63,50.25 63,34.13 62.75,33.88 v61.5,33.88 | IC4.44 46.5,34 v46.88,33.63
  Bottom 0.203: v46.88,33.63 61.25,33.63 v61.5,33.88
EN5  (via drill 0.25 pad 0.55)
  Top 0.203: IC15.P10 74.62,50 74.75,49.88 74.75,48.25 v74.62,48.13 | v69.5,48 64,48 63.75,47.75 v63.75,36.88 | IC4.1 49.86,36.59 v49.95,36.6
  Bottom 0.203: v74.62,48.13 69.62,48.13 v69.5,48 | v49.95,36.6 63.48,36.6 v63.75,36.88
EN6  (via drill 0.25 pad 0.55)
  Top 0.203: IC18.P2 69,67.75 68.75,68 67.88,68 67.62,67.75 67.62,65.75 67.5,65.63 66.38,65.63 v66.12,65.38 | IC4.2 50.71,37.39 v50.73,37.4 | v66.25,55.38 61.5,55.38 61.25,55.13 61.25,37.63 v61.02,37.4
  Bottom 0.203: v50.73,37.4 60.12,37.4 v61.02,37.4 | v66.12,65.38 66.12,55.38 v66.25,55.38
EN7  (via drill 0.25 pad 0.55)
  Top 0.203: IC18.P10 74.5,67.25 74.75,67 74.75,65.38 v74.5,65.13 | IC4.3 v49.94,38.19 v49.95,38.2 | v70.62,54.75 62.5,54.75 62.25,54.5 62.25,38.48 v61.98,38.2
  Bottom 0.203: v74.5,65.13 70.62,65.13 70.5,65 70.5,54.88 v70.62,54.75 | v49.95,38.2 v61.98,38.2
EN8  (via drill 0.25 pad 0.55)
  Top 0.203: IC4.20 40.1,55.85 v40.25,56 | IC12.P2 62,56.25 v61.75,56
  Bottom 0.203: v61.75,56 v40.25,56
EN9  (via drill 0.25 pad 0.55)
  Top 0.203: IC12.P10 62.5,74.63 62.62,74.75 64.25,74.75 v64.38,74.63 | IC4.21 39.3,56.3 v39.62,56.63 | v64.5,69.25 64.5,56.88 v64.25,56.63
  Bottom 0.203: v64.38,74.63 64.38,69.38 v64.5,69.25 | v64.25,56.63 v39.62,56.63
EN10  (via drill 0.25 pad 0.55)
  Top 0.203: IC14.P2 51,55 v50.62,54.63 | IC4.22 38.5,54.5 v38.62,54.63
  Bottom 0.203: v38.62,54.63 49.62,54.63 50,54.63 v50.62,54.63
EN11  (via drill 0.25 pad 0.55)
  Top 0.203: IC14.P10 51.5,74.5 51.62,74.63 53.38,74.63 v53.5,74.5 | v53.62,69.25 53.62,55.63 v53.38,55.38 | IC4.23 36.75,55.13 v37,55.38
  Bottom 0.203: v53.5,74.5 53.5,69.38 v53.62,69.25 | v37,55.38 52.25,55.38 52.5,55.38 v53.38,55.38
EN12  (via drill 0.25 pad 0.55)
  Top 0.203: IC16.P2 35.25,66.08 v35.5,65.83 | IC4.24 35.46,43.79 35.25,44 35.25,52.88 v35.5,53.13 | v44.38,53.13 44.5,53.25 v44.5,65.88
  Bottom 0.203: v35.5,53.13 v44.38,53.13 | v35.5,65.83 35.62,65.73 44.38,65.75 v44.5,65.88
EN13  (via drill 0.25 pad 0.55)
  Top 0.203: IC16.P10 35.75,74.5 35.88,74.63 37.62,74.63 v37.75,74.5 | IC4.25 35.01,42.99 34.75,43.25 34.75,53.63 v35,53.88 | v45.12,69.5 v45.12,53.88
  Bottom 0.203: v37.75,74.5 37.75,70 38,69.75 44.88,69.75 v45.12,69.5 | v45.12,53.88 v35,53.88
EN14  (via drill 0.25 pad 0.55)
  Top 0.203: IC19.P2 22.38,66.13 v22.62,65.88 | IC4.26 34.44,42.19 34.25,42.38 34.25,52.13 v34,52.38 | v34.12,65.88 34.12,65.38 34.38,65.13 42.88,65.13 43.12,64.88 v43.12,52.25
  Bottom 0.203: v22.62,65.88 v34.12,65.88 | v34,52.38 43,52.38 v43.12,52.25
EN15  (via drill 0.25 pad 0.55)
  Top 0.203: IC19.P10 22.88,74.5 23,74.63 24.75,74.63 v24.88,74.5 | IC4.27 33.99,41.39 33.75,41.63 33.75,51.38 v33.5,51.63 | v43.75,69.2 v43.75,51.5
  Bottom 0.203: v24.88,74.5 24.88,69.38 25.12,69.13 43.62,69.13 v43.75,69.2 | v43.75,51.5 33.62,51.5 v33.5,51.63
FT_CTS  (via drill 0.25 pad 0.55)
  Top 0.203: v28.38,42.86 IC3.11 | IC4.29 33.46,39.79 33.25,40 33.25,42.63 v33,42.88
  Top 0.254: 26.09,42.88 IC3.11 | 28.51,42.86 v28.38,42.86
  Top 0.305: 26.09,42.88 IC3.11
  Bottom 0.203: v33,42.88 28.39,42.88 v28.38,42.86
FT_RTS  (via drill 0.25 pad 0.55)
  Top 0.203: v24.42,37.66 IC3.3 | IC4.28 35.29,40.59 v35.25,40.63 | v32.5,40.38 v32.5,38
  Top 0.305: IC3.3
  Bottom 0.203: v24.42,37.66 32.16,37.66 v32.5,38 | v35.25,40.63 32.75,40.63 v32.5,40.38
FT_RXD  (via drill 0.25 pad 0.55)
  Top 0.203: IC3.5 27.5,38.96 v27.63,39.09 | v31.88,39.5 31.88,36.76 32.05,36.59 IC4.33
  Top 0.305: 26.12,38.93 IC3.5
  Top 0.406: 26.09,38.97 IC3.5
  Bottom 0.203: v31.88,39.5 28.05,39.5 v27.63,39.09
FT_TXD  (via drill 0.25 pad 0.55)
  Top 0.203: 26.06,36.39 IC3.1 v26.08,35.81 | v34.71,37.39 IC4.32 | IC4.32
  Bottom 0.203: v26.08,35.81 26.26,35.63 34.25,35.63 34.5,35.88 34.5,37.19 v34.71,37.39
GND  (via drill 0.35 pad 0.65)
  Top 0.305: IC1.P$2 14.44,48.36 v14.4,48.33 | IC4.30
  other vias: 18.92,46.12 5.85,54.24 5.85,53.03 11.89,53.79 26.09,46.85 13.84,45.86 13.13,43.59 15.5,40.25 5.38,42.33 5.38,40.88 5.16,20.05 29.9,37.04 29.31,52.89 30.1,54.56 2.44,26.72 33.48,37.23 27.68,41.04 17.1,36.03 7.19,13.22 18.14,30.84 42.48,30.17 41.3,28.37 36.85,29.37 52.93,43.04 40.85,50.87 31,22.21 37.07,22.24 43.17,22.16 49.17,22.11 54.85,22.21 39.06,39.83 40.81,37.58 44.56,38.58 41.81,44.58 29.75,67.74 22.63,72.49 35.5,72.49 51.25,72.49 62.25,72.49 72.5,67.49 72.5,50.24 72.5,37.99 72.5,17.99 44.5,67.74 40.8,63.47 23.13,63.24 18.25,63.24 43.31,43.45 70.41,16.15 27.26,16.97 27.01,20.34 33.14,15.54 39.24,15.57 45.29,15.54 51.26,15.47 57.01,15.47 25.63,70.87 38.5,70.99 54.25,70.74 65,71.12 70.43,65.79 70.43,48.77 70.55,36.47 68,19.24 68,49.24 68,52.24 68,56.24 68,65.24 32.75,67.74 36.75,67.74 40.75,67.74 48.75,67.74 52.75,67.74 56.75,67.74 60.75,67.74 63.75,67.74 24.75,67.74 68,23.24 68,26.24 68,29.24 68,32.24 68,39.24 68,45.19 68,59.24 68,62.24 69.5,57.79 69.53,46.12 69.5,43.79 69.5,30.79 69.5,33.79 69.5,27.79 69.5,24.79 66.5,24.79 66.5,27.79 66.5,30.79 66.5,33.79 66.5,36.79 66.5,39.79 66.5,43.79 66.5,46.79 66.5,49.79 66.5,52.79 50.35,66.22 54.35,66.22 59.35,66.22 63.35,66.22 46.35,66.22 56.35,69.27 60.35,69.27 38.8,63.47 38.8,61.47 38.8,62.47 39.8,63.47 47.8,63.47 47.8,59.47 51.8,59.47 51.8,63.47 56.8,63.47 56.8,59.47 62.8,59.47 62.8,63.47 59.8,63.47 59.8,59.47 64.2,49.22 64.05,53.19 63.05,30.19 63.05,27.19 63.05,24.19 63.05,21.19 62.05,13.19 62.05,11.19 66.05,11.19 68.05,11.19 62.08,16.99 64.98,16.99 66.5,19.79 56.7,46.47 33.23,61.34 75.2,53.07 75.2,40.92 75.25,20.89 59.48,75.44 48.43,75.39 32.7,75.44 20,75.39 22.1,38.03 26.14,30.84 22.14,26.84 73.03,73.34 52.39,35.05
  pour Bottom (rank 2): 15.36,0 83.5,0 83.5,10.5 87,10.5 87,80 83.5,80 83.5,87 3.5,87 3.5,73.5 0,73.5 0,25 3.5,25 3.5,3.5 15.36,3.5
  pour Top (rank 2): 83.5,0 83.5,10.5 87,10.5 87,80 83.5,80 83.5,87 3.5,87 3.5,73.5 0,73.5 0,25 3.5,25 3.5,3.5 15.36,3.5 15.36,0
IN0  (via drill 0.25 pad 0.55)
  Top 0.203: IC4.4 50.86,38.99 v50.88,39 | v56.15,38.9 56.15,25.15 v55.88,24.88 | R10.2 31.95,24.45 v32.38,24.88
  Bottom 0.203: v50.88,39 56.05,39 v56.15,38.9 | v32.38,24.88 v55.88,24.88
IN1  (via drill 0.25 pad 0.55)
  Top 0.203: IC4.5 49.96,39.79 v49.95,39.8 | v56.88,39.63 56.88,24.45 v56.67,24.25 | R11.2 38.02,23.9 v38.38,24.25
  Bottom 0.203: v49.95,39.8 56.7,39.8 v56.88,39.63 | v38.38,24.25 55.25,24.25 56.12,24.25 v56.67,24.25
IN2  (via drill 0.25 pad 0.55)
  Top 0.203: IC4.6 50.76,40.59 v50.77,40.6 | v57.5,40.5 57.62,40.38 57.62,23.93 v57.38,23.68 | R12.2 44.12,23.38 v44.38,23.65
  Bottom 0.203: v50.77,40.6 57.27,40.6 v57.5,40.5 | v44.38,23.65 57.35,23.65 v57.38,23.68
IN3  (via drill 0.25 pad 0.55)
  Top 0.203: IC4.7 49.89,41.39 v49.95,41.4 | v58.3,41.63 58.3,23.43 v58.08,23.13 | R13.2 v50.12,23
  Bottom 0.203: v49.95,41.4 58.08,41.4 v58.3,41.63 | v58.08,23.13 50.25,23.13 v50.12,23
IN4  (via drill 0.25 pad 0.55)
  Top 0.203: IC4.10 49.69,43.79 v50.15,44.25 | v59,44 59,22.65 58.55,22.2 R14.2
  Bottom 0.203: v50.15,44.25 58.75,44.25 v59,44
IN_SPK_N  (via drill 0.25 pad 0.55)
  Top 0.203: IC16.P7 39,72.75 39.25,72.5 | IC16.P11 35.25,75 35.5,75.25 39,75.25 39.25,75 39.25,72.5 | IC19.P7 26.12,72.75 26.38,72.5 | IC19.P11 22.38,75 22.62,75.25 26.12,75.25 26.38,75 26.38,72.5 | 26.38,72.5 26.38,67.5 v26.88,67 | 39.25,72.5 39.25,67.5 v39.75,67 | IC14.P7 54.88,72.75 55.12,72.5 | IC14.P11 51,75 51.25,75.25 54.88,75.25 55.12,75 55.12,72.5 | IC12.P11 62,75 62.25,75.25 65.88,75.25 66.12,75 66.12,72.38 | 66.12,72.38 66.12,67.38 v66.5,67 | IC12.P7 65.75,72.75 66.12,72.38 | 55.12,72.5 55.12,67.25 v55.38,67 | IC18.P7 72.75,64 72.5,63.75 | 72.5,63.75 67.5,63.75 v67.25,63.5 | IC18.P11 75,67.75 75.25,67.5 75.25,64.13 75,63.75 72.5,63.75 | 72.5,46.75 75.25,46.75 75.5,47 75.5,50.25 75.25,50.5 IC15.P11 | 72.5,46.75 67.75,46.75 v67.25,46.25 | IC15.P7 72.75,47 72.5,46.75 | IC13.P11 75.5,38.25 75.75,38 75.75,34.75 75.5,34.5 72.5,34.5 | 72.5,34.5 67.75,34.5 v67.25,34 | IC13.P7 72.75,34.75 72.5,34.5 | IC11.P11 75.5,18.25 75.75,18 75.75,14.25 75.5,14 72.75,14 | 72.75,14 67.75,14 v67.25,13.5 | IC11.P7 72.75,14
  Top 0.508: J1.P1 64.5,13.25 64.75,13.5 v67.25,13.5
  Bottom 0.203: 67.5,63.75 v67.25,63.5
  Bottom 0.508: 36.25,67 v39.75,67 v26.88,67 v55.38,67 v66.5,67 67.25,66.25 v67.25,63.5 v67.25,46.25 v67.25,34 v67.25,13.5
IN_SPK_P  (via drill 0.25 pad 0.55)
  Top 0.203: IC16.P3 35.75,68.75 v36,68.5 | IC19.P3 22.88,68.75 v23.12,68.5 | IC19.P15 20.25,72.25 20,72 20,68.75 v20.25,68.5 | IC16.P15 33.12,72.25 32.88,72 32.88,68.75 v33.12,68.5 | IC14.P3 51.5,68.63 v51.62,68.5 | IC14.P15 48.88,72.25 48.62,72 48.62,68.63 v48.75,68.5 | IC18.P3 68.5,67.25 v68.38,67.38 | IC18.P15 72.25,70 72,70.25 67.25,70.25 67,70 v67,68.5 | IC12.P3 62.5,69 v63,68.5 | IC12.P15 59.75,72.25 59.5,72 59.5,68.75 v59.75,68.5 | IC15.P3 69,50 v68.75,49.75 | IC13.P3 69.25,37.75 v68.75,37.25 | IC11.P3 69.25,17.75 v68.75,17.25 | IC13.P15 72.25,40.5 72,40.75 69.25,40.75 v68.75,40.25 | IC15.P15 72.25,52.63 72,52.88 69,52.88 v68.75,52.63 | IC11.P15 72.25,20.38 72,20.63 69,20.63 v68.75,20.38
  Top 0.508: J1.P2 60.75,14.13 61.25,14.63 68.62,14.63 v68.75,14.75
  Bottom 0.508: 33,68.5 v33.12,68.5 v36,68.5 v23.12,68.5 | v20.25,68.5 v23.12,68.5 | v23.12,68.5 v48.75,68.5 v51.62,68.5 v59.75,68.5 v63,68.5 v67,68.5 67.25,68.5 v68.38,67.38 68.75,67 v68.75,52.63 v68.75,49.75 v68.75,40.25 v68.75,37.25 v68.75,20.38 v68.75,17.25 v68.75,14.75
N$2
  Top 0.254: R4.1 24.02,17.68 IC5.4
N$3
  Top 0.254: IC7.4 R11.1
N$4
  Top 0.254: IC6.4 31.93,20.85 R10.1
N$5
  Top 0.254: IC8.4 R12.1
N$6
  Top 0.254: IC9.4 R13.1
N$7
  Top 0.254: IC10.4 R14.1
N$23
  Top 0.254: R3.1 6.79,16.94 STATE.A
N$38
  Top 0.305: 16.04,43.52 C8.1
  Top 0.356: IC3.17 16.04,43.52
N$39
  Top 0.305: IC1.P$5 20.92,48.36 21.64,49.09 21.64,50.36 21.01,50.99 21.49,50.99 L1.2 | 9.66,49.49 8.83,49.51 USB.P$1 | C2.1 11.92,51.12
  Top 0.406: 21.01,50.99 11.79,50.99 | 11.79,50.99 11.16,50.99 9.66,49.49 | 11.92,51.12 11.79,50.99
N$40
  Top 0.254: IC1.P$1 14.39,49.31 13.92,48.85 8.87,48.85
  Top 0.305: 8.81,48.78 USB.P$2 8.87,48.85
N$47
  Top 0.305: RX.A R2.1
N$48
  Top 0.305: IC3.23 17.89,39.62 17.58,39.31 17.58,38.04 16.05,36.52 15.54,36.52 TX.K
N$49
  Top 0.305: IC3.22 17.52,40.27 16.82,39.56 16.82,39.31 16.31,38.8 15.55,38.8 RX.K
N$50
  Top 0.254: IC1.P$3 14.35,47.41 13.82,47.95 8.8,47.95
  Top 0.305: 8.81,47.93 USB.P$3 8.8,47.95
N$59
  Top 0.305: 8.51,51.63 USB.SHIELD_4
  Top 0.406: CUSB.1 8.51,51.63
N$61
  Top 0.305: 3.22,51.63 USB.SHIELD_1
  Top 0.406: RUSB.1 3.22,51.63
N$62
  Top 0.305: TX.A R1.1
OSC2
  Top 0.305: IC4.37 40.9,31.79 OSC.P$3
OUT0  (via drill 0.25 pad 0.55)
  Top 0.203: IC4.11 48.25,45 v48.75,45.5 | v55.38,45.25 55.38,25.88 v55.12,25.63 | IC5.2 25,24.13 v25.38,24.5
  Bottom 0.203: v48.75,45.5 55.12,45.5 v55.38,45.25 | v55.12,25.63 31.25,25.63 30.12,24.5 v25.38,24.5
OUT_SPK0_N  (via drill 0.25 pad 0.55)
  Top 0.203: IC11.P8 73.25,14.75 v73.38,14.63 | v73.62,11.5 X7.P4
  Bottom 0.203: v73.38,14.63 73.38,11.75 v73.62,11.5
OUT_SPK0_P  (via drill 0.25 pad 0.55)
  Top 0.203: IC11.P16 71.35,19.4 v70.75,20
  Bottom 0.203: v70.75,20 77,20 77.25,19.75 77.25,15.25 77.5,15 X7.P3
OUT_SPK1_N
  Top 0.203: IC11.P12 78.75,18.75 X7.P2
OUT_SPK1_P  (via drill 0.25 pad 0.55)
  Top 0.203: IC11.P4 70.25,17.25 v70,17
  Bottom 0.203: v70,17 70,21.68 70.3,21.98 78.97,21.98 X7.P1
OUT_SPK2_N  (via drill 0.25 pad 0.55)
  Top 0.203: IC13.P8 73.25,35.25 v73.38,35.13
  Bottom 0.203: v73.38,35.13 73.38,31.5 73.62,31.25 X6.P8
OUT_SPK2_P  (via drill 0.25 pad 0.55)
  Top 0.203: IC13.P16 71.35,39.4 v70.75,40
  Bottom 0.203: v70.75,40 76.75,40 77,39.75 77,35 77.25,34.75 X6.P7
OUT_SPK3_N
  Top 0.203: IC13.P12 78.25,38.75 X6.P6
OUT_SPK3_P  (via drill 0.25 pad 0.55)
  Top 0.203: IC13.P4 70.25,37.25 v70,37
  Bottom 0.203: v70,37 70,41.43 70.33,41.75 X6.P5
OUT_SPK4_N  (via drill 0.25 pad 0.55)
  Top 0.203: IC15.P8 73.25,47.5 v73.38,47.38
  Bottom 0.203: v73.38,47.38 73.38,45.5 73.62,45.25 X6.P4
OUT_SPK4_P  (via drill 0.25 pad 0.55)
  Top 0.203: IC15.P16 71.1,51.65 v70.5,52.25
  Bottom 0.203: v70.5,52.25 76.75,52.25 77,52 77,49 77.25,48.75 X6.P3
OUT_SPK5_N
  Top 0.203: IC15.P12 77.5,51 X6.P2
OUT_SPK5_P  (via drill 0.25 pad 0.55)
  Top 0.203: IC15.P4 70,49.5 v69.75,49.25
  Bottom 0.15: v69.75,49.25 69.75,53.25 70,53.5 71.88,53.5 72.12,53.75 72.12,55.5 72.38,55.75 X6.P1
OUT_SPK6_N  (via drill 0.25 pad 0.55)
  Top 0.203: IC18.P8 73.25,64.5 v73.38,64.38
  Bottom 0.203: v73.38,64.38 78.75,64.38 79,64.63 X5.P4
OUT_SPK6_P  (via drill 0.25 pad 0.55)
  Top 0.203: IC18.P16 71.1,68.9 v70.5,69.5
  Bottom 0.203: v70.5,69.5 X5.P3
OUT_SPK7_N
  Top 0.203: IC18.P12 76.25,68.25 76.5,68.5 76.5,72.75 76.75,73 X5.P2
OUT_SPK7_P  (via drill 0.25 pad 0.55)
  Top 0.203: IC18.P4 70.12,66.75 v69.88,66.5
  Bottom 0.203: v69.88,66.5 69.88,76.13 70.25,76.5 X5.P1
OUT_SPK8_N  (via drill 0.25 pad 0.55)
  Top 0.203: IC12.P8 65.38,73.25 v65.5,73.38
  Bottom 0.203: X4.P8 69.25,79 69.12,78.88 69.12,73.5 69,73.38 v65.5,73.38
OUT_SPK8_P  (via drill 0.25 pad 0.55)
  Top 0.203: IC12.P16 60.85,71.35 v60.25,70.75
  Bottom 0.203: v60.25,70.75 60.25,77 60.5,77.25 67,77.25 67.25,77.5 X4.P7
OUT_SPK9_N
  Top 0.203: IC12.P12 61.5,78.75 61.75,79 X4.P6
OUT_SPK9_P  (via drill 0.25 pad 0.55)
  Top 0.203: IC12.P4 63,70.25 v63.25,70
  Bottom 0.203: v63.25,70 59,70 58.75,70.25 58.75,78.75 59,79 X4.P5
OUT_SPK10_N  (via drill 0.25 pad 0.55)
  Top 0.203: IC14.P8 54.38,73.25 v54.5,73.38
  Bottom 0.203: v54.5,73.38 56.5,73.38 56.75,73.63 X4.P4
OUT_SPK10_P  (via drill 0.25 pad 0.55)
  Top 0.203: IC14.P16 49.85,71.23 v49.25,70.63
  Bottom 0.203: v49.25,70.63 49.25,77 49.5,77.25 53,77.25 53.25,77.5 X4.P3
OUT_SPK11_N
  Top 0.203: IC14.P12 50.5,78.25 X4.P2
OUT_SPK11_P  (via drill 0.25 pad 0.55)
  Top 0.203: IC14.P4 52,70.25 v52.25,70
  Bottom 0.203: v52.25,70 46.5,70 46.25,70.25 X4.P1
OUT_SPK12_N  (via drill 0.25 pad 0.55)
  Top 0.203: IC16.P8 38.5,73.25 v38.62,73.38
  Bottom 0.203: v38.62,73.38 40.62,73.38 40.75,73.5 X3.P8
OUT_SPK12_P  (via drill 0.25 pad 0.55)
  Top 0.203: IC16.P16 34.1,71.1 v33.5,70.5
  Bottom 0.203: v33.5,70.5 33.5,77 33.75,77.25 37,77.25 37.25,77.5 X3.P7
OUT_SPK13_N
  Top 0.203: IC16.P12 34.75,78 X3.P6
OUT_SPK13_P  (via drill 0.25 pad 0.55)
  Top 0.203: IC16.P4 36.25,70.13 v36.5,69.88
  Bottom 0.203: v36.5,69.88 30.5,69.88 30.25,70.13 X3.P5
OUT_SPK14_N  (via drill 0.25 pad 0.55)
  Top 0.203: IC19.P8 25.62,73.25 v25.75,73.38
  Bottom 0.203: v25.75,73.38 26.62,73.38 26.75,73.5 X3.P4
OUT_SPK14_P  (via drill 0.25 pad 0.55)
  Top 0.203: IC19.P16 21.23,71.1 v20.62,70.5
  Bottom 0.203: v20.62,70.5 20.62,77 20.88,77.25 23,77.25 23.25,77.5 X3.P3
OUT_SPK15_N
  Top 0.203: IC19.P12 21.88,78.75 21.62,79 X3.P2
OUT_SPK15_P  (via drill 0.25 pad 0.55)
  Top 0.203: IC19.P4 23.38,70.13 v23.62,69.88
  Bottom 0.203: v23.62,69.88 19.62,69.88 19.38,70.13 19.38,77.25 19,77.63 16.62,77.63 16.25,78 X3.P1
PDI-CLK  (via drill 0.25 pad 0.55)
  Top 0.203: IC4.35 39.3,33.53 v39.08,33.3 | v35.02,33.18 35.02,26.48 v35.25,26.25
  Bottom 0.203: v39.08,33.3 35.15,33.3 v35.02,33.18 | v35.25,26.25 51.62,26.25 51.88,26.5 51.88,27.84 PDI.5
PDI-DATA  (via drill 0.25 pad 0.55)
  Top 0.203: 38.5,34.58 IC4.34 v37.65,33.99 v37.65,33.98 | v34,33.53 34,27.38 v34.25,27.13
  Bottom 0.203: v37.65,33.98 34.45,33.98 v34,33.53 | PDI.1 46.02,27.13 v34.25,27.13
STATE  (via drill 0.25 pad 0.55, 0.35 pad 0.65)
  Top 0.254: v10.25,32.5 9.78,32.03 9.78,20.49 9.5,20.22 R3.2 | IC4.36 40.1,35.78 39.88,36 32.25,36 32,35.75 32,32.88 31.62,32.5 v31.5,32.5
  Bottom 0.254: v10.25,32.5 v31.5,32.5
USBDM
  Top 0.254: IC1.P$6 17.71,49.31 17.4,49 17.4,45.91 | 18.77,44.22 17.88,44.22 17.4,44.71 17.4,45.91 | C4.1 17.39,45.9 17.4,45.91
  Top 0.305: 18.77,44.22 IC3.16
USBDP
  Top 0.254: IC1.P$4 21.72,47.41 22.28,46.85 | 22.28,46.83 22.28,45.7 21.4,44.82 IC3.15 | C3.1 22.29,46.84
  Top 0.305: IC3.15 | 22.28,46.85 22.28,46.83 22.29,46.84
VCC  (via drill 0.25 pad 0.55, 0.35 pad 0.65)
  Top 0.305: IC19.P14 20.32,72.75 | 20.32,72.75 C30.1 | 20.32,72.75 19.25,72.75 19,72.5 19,65.63 v19.5,65.13 | 32.9,72.75 C27.1 | v32.25,65.13 31.75,65.63 31.75,72.63 31.88,72.75 32.9,72.75 | v47.88,65.13 47.38,65.63 47.38,72.5 47.62,72.75 48.4,72.75 C25.1 48.65,72.75 IC14.P14 | 32.9,72.75 IC16.P14 | v65.5,64.5 v65.5,70.5 | 59.7,72.75 58.25,72.75 58,72.5 58,65.63 v58.5,65.13 | IC12.P14 59.7,72.75 | 59.7,72.75 C23.1 | IC18.P14 72.75,70.6 C29.1 v66.7,70.8 | v65.5,53.38 66.12,54 72.5,54 72.75,53.75 72.75,52.93 C26.1 72.75,52.88 IC15.P14 | 72.75,40.78 72.75,41.88 72.5,42.13 66.12,42.13 v65.5,41.5 | IC13.P14 72.75,40.78 | 72.75,40.78 C24.1 | 72.75,20.73 72.75,21.63 72.5,21.88 66.12,21.88 v65.5,21.25 | IC11.P14 72.75,20.73 | 72.75,20.73 C22.1
  Top 0.406: D1.A v60.62,51.63
  Top 0.508: v42.5,60.63 42.33,60.45 C31.1 IC17.5
  Bottom 0.305: v66.7,70.8 65.8,70.8 v65.5,70.5
  Bottom 0.406: v60.62,51.63 65.25,51.63 65.5,51.88
  Bottom 0.508: v19.5,65.13 v32.25,65.13 42.12,65.13 | 42.12,65.13 v47.88,65.13 v58.5,65.13 64.88,65.13 v65.5,64.5 v65.5,53.38 65.5,51.88 v65.5,41.5 v65.5,21.25 | v42.5,60.63 42.5,64.75 42.12,65.13
VCCIO  (via drill 0.35 pad 0.65)
  Top 0.203: C9.1 28.63,38.49 28.62,38.5 | C10.1 29.41,49.91 29.31,49
  Top 0.305: 28.81,49.84 C10.1 | C12.1 35.14,38.19 IC4.31 39.11,38.19 v42.5,41.58 | 42.5,41.38 v42.5,41.58 | v42.5,41.58 42.5,41.38 IC4.39 C13.1 | C15.1 50.66,42.99 IC4.9 43.91,42.99 v42.5,41.58 | C14.1 40.9,48.33 IC4.19 40.9,43.18 v42.5,41.58 | OSC.P$4 36.89,31.75 | 36.89,31.75 C11.1 | 36.89,31.75 36.89,34.45 v36.5,34.85 | IC6.5 C17.1 | IC7.5 C18.1 | IC8.5 C19.1 41.23,20.85 v41.2,20.88 | IC9.5 C20.1 48.2,20.88 v47,20.88 | IC10.5 C21.1 52.88,20.9 v52.85,20.88 | v48,34.85 48,30.78 47.62,30.4 PDI.2 | v11.5,34.85 11.5,22.13 12,21.63 JP1.1 | JP2.1 54.17,51.62 54.17,47.63 53.8,47.25 49.12,47.25 46.12,44.25 42.75,44.25 42.5,44 v42.5,41.58
  Top 0.356: IC3.4 28.62,38.32
  Top 0.406: CLKIN.1 6.76,34.17 9.83,34.17 v10.51,34.85 | 28.62,38.32 28.62,38.5 | 29.14,49.85 C10.1 | 29.31,49.79 29.5,49.98 | v28.88,42 | v28.88,42 28.84,42.03 | 41.2,20.85 v41.2,20.88 | v29.02,20.88 30,20.88 C17.1 | v35.12,20.88 36.08,20.88 C18.1 | v33,34.85 33.25,34.6 33.25,21.4 v33.77,20.88 | D1.C JP2.1
  Top 0.61: C9.1 28.63,34.97 28.75,34.85 v29.16,34.85 | IC2.5 28.81,49.84 | 29.31,49.79 29.31,49 29.31,42.5 28.84,42.03 28.62,41.81 28.62,38.5
  Bottom 0.203: v42.5,41.58 42.5,41.59
  Bottom 0.406: v10.51,34.85 v11.5,34.85 v29.16,34.85 | 29,41.88 v28.88,42 | v52.85,20.88 v47,20.88 v41.2,20.88 v35.12,20.88 | v35.12,20.88 40.15,20.88 | v35.12,20.88 v33.77,20.88 v29.02,20.88
  Bottom 0.61: 42.5,41.59 29.29,41.59 v28.88,42 | v29.16,34.85 v33,34.85 v36.5,34.85 v48,34.85
VDD_OUT  (via drill 0.35 pad 0.65)
  Top 0.305: IC5.5 C16.1 v25.12,15.75 | JP1.2 16.25,16 v16.5,15.75
  Bottom 0.305: v16.5,15.75 v25.12,15.75

### Text on the board
tPlace: Licensed under the TAPR Open / Hardware License (www.tapr.org/OHL) / / Copyright 2018 Artur Silva and Filipe Carvalho | -15+ | -14+ | -13+ | -12+ | -11+ | -10+ | -09+ | -08+ | -07+ | -06+ | harp audio switch v1.0 | 5V / Only! | Hardware Platform | www.cf-hw.org | 0 | 1 | -05+ | address | Licensed under the TAPR Open Hardware / License (www.tapr.org/OHL) | -04+ | -03+ | -02+ | 3V | 5V | -01+ | output | voltage | selector | -00+ | GND | +5V | GND | DO0 | GND | DI0 | DI1 | DI2 | DI3 | DI4